# Altium project lv_io_project.PrjPCB (part 1 of 2)
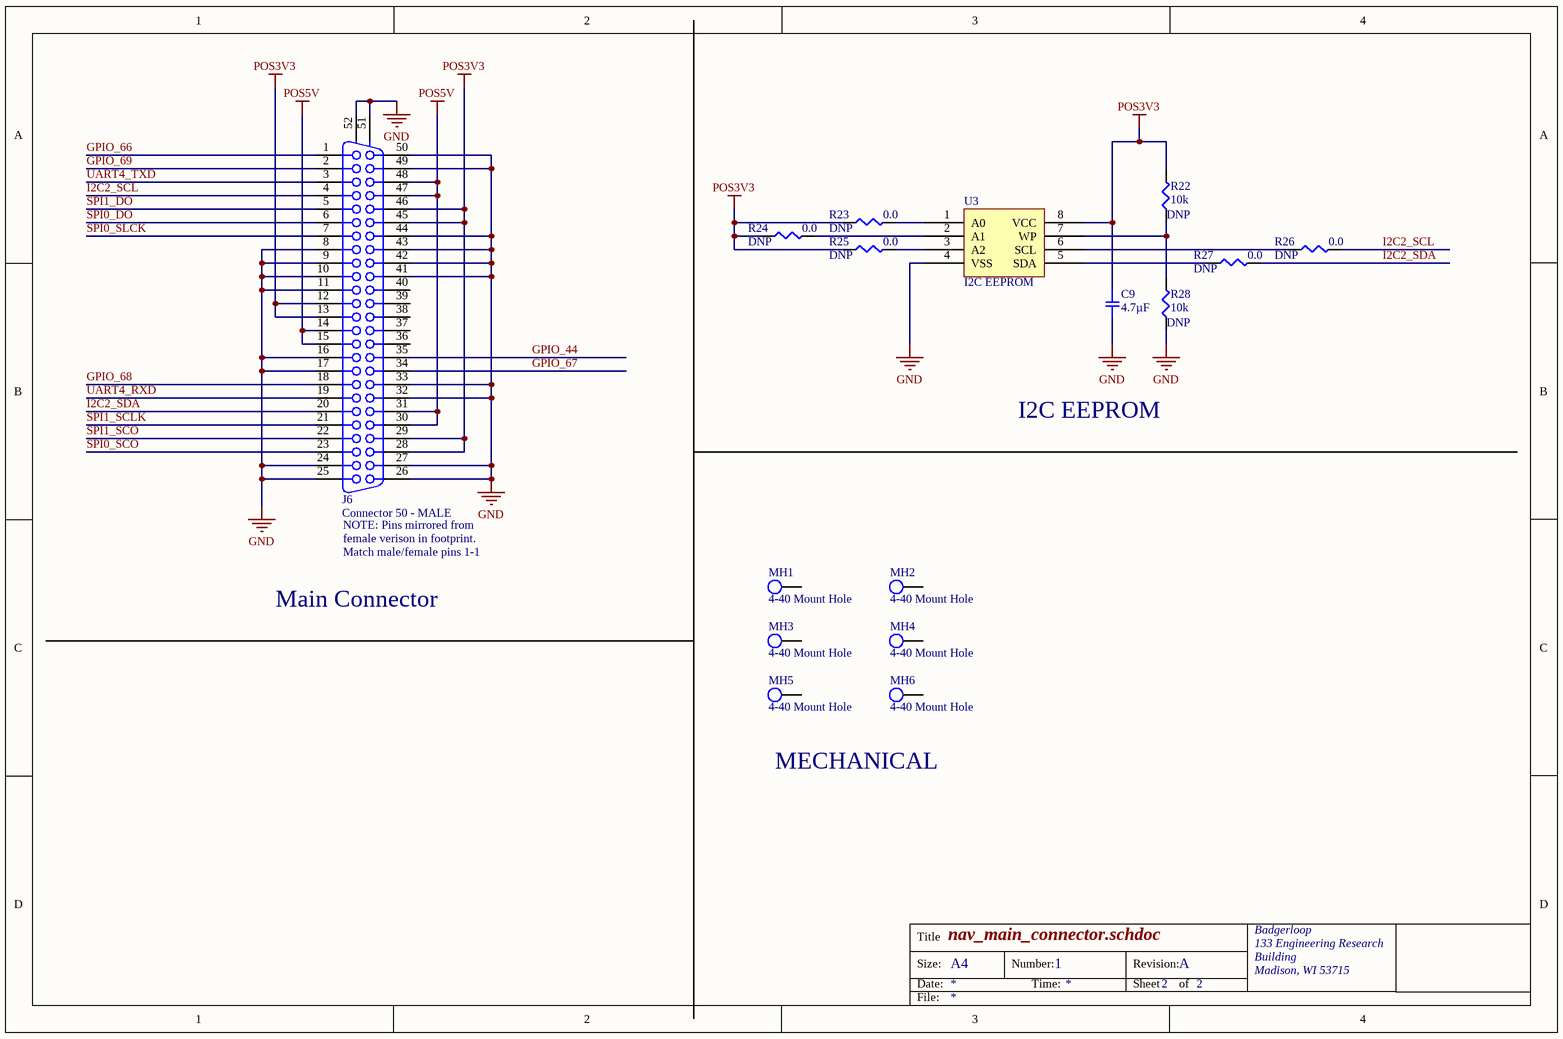
[diagram p0: lv_io_main_connector.SchDoc]
Engineer: Ryan Castle; PCB_Designer: Ryan Castle; Project: LV_IO; Revision: A; SerialNumber: 2019_03_A_1
9 sheets, 297 parts. Net scope: global (net labels, ports and power ports of the same name join across sheets).
Board file: lv_io_pcb.PcbDoc
Sheets:
  lv_io_main_connector.SchDoc
  lv_io_accel.SchDoc
  lv_io_harness.SchDoc
  lv_io_retro.SchDoc
  lv_io_pressure.SchDoc
  lv_io_solenoid_ctl.SchDoc
  lv_io_solenoid_drv.SchDoc
  lv_io_analog_input.SchDoc
  lv_io_lim.SchDoc

## Sheet lv_io_main_connector.SchDoc: nav_main_connector.schdoc
size A4; Engineer: Ryan Castle; Organization: Badgerloop; Address1: 133 Engineering Research; Address2: Building; Address3: Madison, WI 53715; DocumentNumber: 1; Revision: A; SheetNumber: 2; SheetTotal: 2

### Parts
C9  4.7µF  [SMD-0805C]
J6  Connector 50 - MALE  [050DSUB1.27-H96-MALE]
MH1  4-40 Mount Hole  [MH]
MH2  4-40 Mount Hole  [MH]
MH3  4-40 Mount Hole  [MH]
MH4  4-40 Mount Hole  [MH]
MH5  4-40 Mount Hole  [MH]
MH6  4-40 Mount Hole  [MH]
R22  10k  [SMD-0402-RES]
R23  0.0  [SMD-0402-RES]
R24  0.0  [SMD-0402-RES]
R25  0.0  [SMD-0402-RES]
R26  0.0  [SMD-0402-RES]
R27  0.0  [SMD-0402-RES]
R28  10k  [SMD-0402-RES]
U3  I2C EEPROM  [SOIC127P600X175-8N]

### Nets
GND: C9.2 J6.8 J6.9 J6.10 J6.11 J6.16 J6.17 J6.24 J6.25 J6.26 J6.27 J6.32 J6.33 J6.41 J6.42 J6.43 J6.44 J6.49 J6.50 J6.51 J6.52 R28.1 U3.4(VSS)
POS3V3: C9.1 J6.12 J6.13 J6.28 J6.29 J6.45 J6.46 R22.2 R23.1 R24.1 R25.1 U3.8(VCC)
POS5V: J6.14 J6.15 J6.30 J6.31 J6.47 J6.48
GPIO_44: J6.35
GPIO_66: J6.1
GPIO_67: J6.34
GPIO_68: J6.18
GPIO_69: J6.2
I2C2_SCL: J6.4 R26.2
I2C2_SDA: J6.20 R27.2
SPI0_DO: J6.6
SPI0_SCO: J6.23
SPI0_SLCK: J6.7
SPI1_DO: J6.5
SPI1_SCLK: J6.21
SPI1_SCO: J6.22
UART4_RXD: J6.19
UART4_TXD: J6.3
NetR22_1: R22.1 R28.2 U3.7(WP)
NetR23_2: R23.2 U3.1(A0)
NetR24_2: R24.2 U3.2(A1)
NetR25_2: R25.2 U3.3(A2)
NetR26_1: R26.1 U3.6(SCL)
NetR27_1: R27.1 U3.5(SDA)

Not connected (* = marked no-connect by the designer): J6 36 37 38 39 40; MH1 46; MH2 46; MH3 46; MH4 46; MH5 46; MH6 46

### Notes on the sheet
- I2C EEPROM
- (near J6) NOTE: Pins mirrored from
- Match male/female pins 1-1
- female verison in footprint.
- Main Connector
- MECHANICAL
- Title
- Size:
- Date:
- A4
- Number:
- Time:
- Revision:
- Sheet
- of
- File:

### Library data of the parts
C9 = GCJ21BR71C475KA01L: CAP CER 4.7UF 16V X7R 0805; Manufacturer: Murata Electronics North America; Factory Stock: 0; Unit Price (USD): 0.44; Minimum Quantity: 1; Tolerance: ±10%; Datasheets: http://www.murata.com/~/media/webrenewal/support/library/catalog/products/capacitor/mlcc/c03e.ashx; Image: //media.digikey.com/Renders/Murata%20Renders/0805%20(2012%20Metric)%20.85mm.jpg; Digi-Key Part Number: 490-10557-1-ND; Part Number: GCJ21BR71C475KA01L; Quantity Available: 53217; @ qty: 0; Packaging: Cut Tape (CT); Series: GCJ; Part Status: Active; Value: 4.7µF; Voltage: 16V; Temperature Coefficient: X7R; Operating Temperature: -55°C ~ 125°C; Features: Soft Termination; Ratings: AEC-Q200; Applications: Automotive, Boardflex Sensitive; Mounting Type: Surface Mount, MLCC; Package / Case: 0805 (2012 Metric); Size / Dimension: 0.079" L x 0.049" W (2.00mm x 1.25mm); Height - Seated (Max): -; Thickness (Max): 0.057" (1.45mm); Lead Spacing: -; Lead Style: -
J6 = Connector 50 - MALE: Receptacle Header Assemby; Manufacturer: HARTING; Manufacturer P/N: 09665627811; Digikey Link: https://www.digikey.com/product-detail/en/harting/09665627811/1195-5057-ND/4322749; Digikey P/N: 1195-5057-ND
R22 R28 = ERJ-2GEJ103X: RES SMD 10K OHM 5% 1/10W 0402; Manufacturer: Panasonic Electronic Components; Factory Stock: 0; Unit Price (USD): 0.00350; @ qty: 1500; Minimum Quantity: 1; Power (Watts): 0.1W, 1/10W; Temperature Coefficient: ±200ppm/°C; Part Number: ERJ-2GEJ103X; Datasheets: http://industrial.panasonic.com/www-cgi/jvcr13pz.cgi?E+PZ+3+AOA0001+ERJ2GEJ103X+7+WW; Image: //media.digikey.com/Photos/Panasonic%20Photos/ERJ-PA2-Series.jpg; Digi-Key Part Number: P10KJCT-ND; Quantity Available: 2560215; Packaging: Cut Tape (CT); Series: ERJ; Part Status: Active; Value: 10k; Tolerance: ±5%; Composition: Thick Film; Features: Automotive AEC-Q200; Operating Temperature: -55°C ~ 155°C; Package / Case: 0402 (1005 Metric); Supplier Device Package: 0402; Size / Dimension: 0.039" L x 0.020" W (1.00mm x 0.50mm); Height - Seated (Max): 0.016" (0.40mm); Number of Terminations: 2; Failure Rate: -; DNP: DNP
R23-R27 = ERJ-2GE0R00X: RES SMD 0.0OHM JUMPER 1/10W 0402; Manufacturer: Panasonic Electronic Components; Factory Stock: 0; Unit Price (USD): 0.00384; @ qty: 1500; Minimum Quantity: 1; Power (Watts): 0.1W, 1/10W; Part Number: ERJ-2GE0R00X; Datasheets: http://industrial.panasonic.com/www-cgi/jvcr13pz.cgi?E+PZ+3+AOA0001+ERJ2GE0R00X+7+WW; Image: //media.digikey.com/Photos/Panasonic%20Photos/ERJ-PA2-Series.jpg; Digi-Key Part Number: P0.0JCT-ND; Quantity Available: 3152483; Packaging: Cut Tape (CT); Series: ERJ; Part Status: Active; Value: 0.0; Tolerance: Jumper; Composition: Thick Film; Features: Automotive AEC-Q200; Temperature Coefficient: -; Operating Temperature: -55°C ~ 155°C; Package / Case: 0402 (1005 Metric); Supplier Device Package: 0402; Size / Dimension: 0.039" L x 0.020" W (1.00mm x 0.50mm); Height - Seated (Max): 0.016" (0.40mm); Number of Terminations: 2; Failure Rate: -; DNP: DNP
U3 = I2C EEPROM: IC EEPROM 32K I2C 1MHZ 8SOIC; Manufacturer: ON Semi; Manufacturer P/N: CAT24C32WI-GT3; Digikey P/N: CAT24C32WI-Gt3CT-ND

## Sheet lv_io_accel.SchDoc: nav_io.schdoc
size A4; Organization: Badgerloop; Address1: 133 Engineering Research; Address2: Building; Address3: Madison, WI 53715; DocumentNumber: 1; Revision: A; SheetNumber: 1; SheetTotal: 2
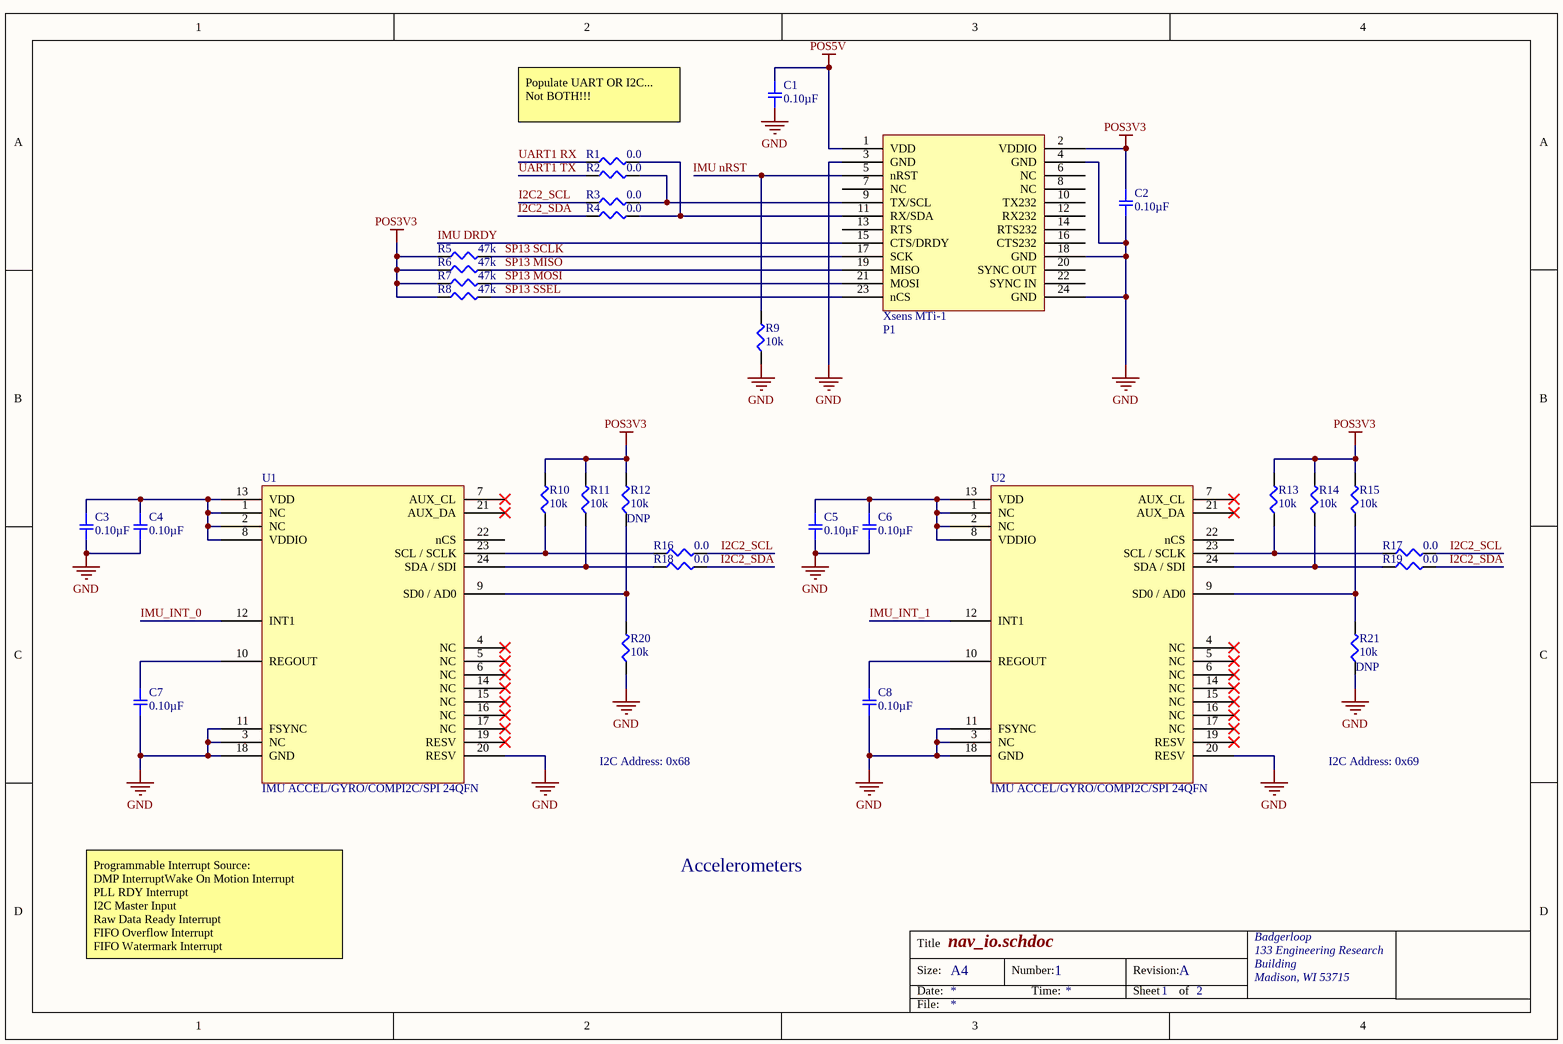
[diagram p1: lv_io_accel.SchDoc]

### Parts
(Parts that share a designator on the sheet are numbered #1, #2 ... from top to bottom, then left to right.)
C1  0.10µF  [SMD-0603C]
C2  0.10µF  [SMD-0603C]
C3  0.10µF  [SMD-0603C]
C4  0.10µF  [SMD-0603C]
C5  0.10µF  [SMD-0603C]
C6  0.10µF  [SMD-0603C]
C7  0.10µF  [SMD-0603C]
C8  0.10µF  [SMD-0603C]
P1  XSNS MTI-1  [MTI-3]  (value not drawn)
R1  0.0  [SMD-0402-RES]
R2  0.0  [SMD-0402-RES]
R3  0.0  [SMD-0402-RES]
R4  0.0  [SMD-0402-RES]
R5  47k  [SMD-0402-RES]
R6  47k  [SMD-0402-RES]
R7  47k  [SMD-0402-RES]
R8  47k  [SMD-0402-RES]
R9  10k  [SMD-0402-RES]
R10  10k  [SMD-0402-RES]
R11  10k  [SMD-0402-RES]
R12  10k  [SMD-0402-RES]
R13#1  10k  [SMD-0402-RES]
R14#1  10k  [SMD-0402-RES]
R15  10k  [SMD-0402-RES]
R16  0.0  [SMD-0402-RES]
R17  0.0  [SMD-0402-RES]
R18  0.0  [SMD-0402-RES]
R19  0.0  [SMD-0402-RES]
R20  10k  [SMD-0402-RES]
R21  10k  [SMD-0402-RES]
U1  IMU ACCEL/GYRO/COMPI2C/SPI 24QFN  [QFN40P300X300X105_HS-25N]
U2  IMU ACCEL/GYRO/COMPI2C/SPI 24QFN  [QFN40P300X300X105_HS-25N]

### Nets
GND: C1.2 C2.2 C3.2 C4.2 C5.2 C6.2 C7.2 C8.2 P1.3(GND) P1.4(GND) P1.18(GND) P1.24(GND) R9.1 R20.1 R21.1 U1.3(NC) U1.11(FSYNC) U1.18(GND) U1.20(RESV) U2.3(NC) U2.11(FSYNC) U2.18(GND) U2.20(RESV)
POS3V3: C2.1 P1.2(VDDIO) R5.1 R6.1 R7.1 R8.1 R10.2 R11.2 R12.2 R13#1.2 R14#1.2 R15.2
POS5V: C1.1 P1.1(VDD)
I2C2_SCL: R3.1 R16.2 R17.2
I2C2_SDA: R4.1 R18.2 R19.2
IMU DRDY: P1.15(CTS/DRDY)
IMU_INT_0: U1.12(INT1)
IMU_INT_1: U2.12(INT1)
SP13 MISO: P1.19(MISO) R6.2
SP13 MOSI: P1.21(MOSI) R7.2
SP13 SCLK: P1.17(SCK) R5.2
SP13 SSEL: P1.23(nCS) R8.2
UART1 RX: R1.1
UART1 TX: R2.1
NetC3_1: C3.1 C4.1 U1.1(NC) U1.2(NC) U1.8(VDDIO) U1.13(VDD)
NetC5_1: C5.1 C6.1 U2.1(NC) U2.2(NC) U2.8(VDDIO) U2.13(VDD)
NetC7_1: C7.1 U1.10(REGOUT)
NetC8_1: C8.1 U2.10(REGOUT)
NetP1_5: P1.5(nRST) R9.2
NetP1_9: P1.9(TX/SCL) R2.2 R3.2
NetP1_11: P1.11(RX/SDA) R1.2 R4.2
NetR10_1: R10.1 R16.1 U1.23(SCL_/_SCLK)
NetR11_1: R11.1 R18.1 U1.24(SDA_/_SDI)
NetR12_1: R12.1 R20.2 U1.9(SD0_/_AD0)
NetR13#1_1: R13#1.1 R17.1 U2.23(SCL_/_SCLK)
NetR14#1_1: R14#1.1 R19.1 U2.24(SDA_/_SDI)
NetR15_1: R15.1 R21.2 U2.9(SD0_/_AD0)

Not connected (* = marked no-connect by the designer): P1 6(NC) 7(NC) 8(NC) 10(TX232) 12(RX232) 13(RTS) 14(RTS232) 16(CTS232) 20(SYNC_OUT) 22(SYNC_IN); U1 4(NC)* 5(NC)* 6(NC)* 7(AUX_CL)* 14(NC)* 15(NC)* 16(NC)* 17(NC)* 19(RESV)* 21(AUX_DA)* 22(nCS); U2 4(NC)* 5(NC)* 6(NC)* 7(AUX_CL)* 14(NC)* 15(NC)* 16(NC)* 17(NC)* 19(RESV)* 21(AUX_DA)* 22(nCS)

### Notes on the sheet
- Populate UART OR I2C...
  Not BOTH!!!
- I2C Address: 0x68
- I2C Address: 0x69
- Accelerometers
- Programmable Interrupt Source:
  DMP InterruptWake On Motion Interrupt
  PLL RDY Interrupt
  I2C Master Input
  Raw Data Ready Interrupt
  FIFO Overflow Interrupt
  FIFO Watermark Interrupt
- Labels drawn without touching a wire or pin: IMU nRST
- Title
- Size:
- Date:
- A4
- Number:
- Time:
- Revision:
- Sheet
- of
- File:
- (in symbol XSNS MTI-1) Xsens MTi-1

### Library data of the parts
C1-C8 = GRM188R72A104KA35J: CAP CER 0.1UF 100V X7R 0603; Manufacturer: Murata Electronics North America; Factory Stock: 0; Unit Price (USD): 0.28; Minimum Quantity: 1; Tolerance: ±10%; Datasheets: http://www.murata.com/~/media/webrenewal/support/library/catalog/products/capacitor/mlcc/c02e.pdf; Image: //media.digikey.com/Renders/Murata%20Renders/ZRB-SERIES-0402.jpg; Digi-Key Part Number: 490-6439-1-ND; Part Number: GRM188R72A104KA35J; Quantity Available: 19148; @ qty: 0; Packaging: Cut Tape (CT); Series: GRM; Part Status: Active; Value: 0.10µF; Voltage: 100V; Temperature Coefficient: X7R; Operating Temperature: -55°C ~ 125°C; Features: -; Ratings: -; Applications: General Purpose; Mounting Type: Surface Mount, MLCC; Package / Case: 0603 (1608 Metric); Size / Dimension: 0.063" L x 0.031" W (1.60mm x 0.80mm); Height - Seated (Max): -; Thickness (Max): 0.035" (0.90mm); Lead Spacing: -; Lead Style: -
P1 = XSNS MTI-1: Manufacturer: Xsens; Manufacturer P/N: MTI-3-DK; Digikey Link: https://www.mouser.com/ProductDetail/Xsens/MTI-3-DK?qs=55YtniHzbhBGvlIRYNoxgQ%3d%3d; Digikey P/N: 512-MTI-3-DK
R1-R4 R16-R19 = ERJ-2GE0R00X: as R23 on sheet lv_io_main_connector; Part Number: ERJ-2GE0R00X; Datasheets: http://industrial.panasonic.com/www-cgi/jvcr13pz.cgi?E+PZ+3+AOA0001+ERJ2GE0R00X+7+WW; Image: //media.digikey.com/Photos/Panasonic%20Photos/ERJ-PA2-Series.jpg; Digi-Key Part Number: P0.0JCT-ND; Quantity Available: 3152483; Packaging: Cut Tape (CT); Series: ERJ; Part Status: Active; Value: 0.0; Tolerance: Jumper; Composition: Thick Film; Features: Automotive AEC-Q200; Temperature Coefficient: -; Operating Temperature: -55°C ~ 155°C; Package / Case: 0402 (1005 Metric); Supplier Device Package: 0402; Size / Dimension: 0.039" L x 0.020" W (1.00mm x 0.50mm); Height - Seated (Max): 0.016" (0.40mm); Number of Terminations: 2; Failure Rate: -
R5-R8 = ERJ-2GEJ473X: RES SMD 47K OHM 5% 1/10W 0402; Manufacturer: Panasonic Electronic Components; Factory Stock: 0; Unit Price (USD): 0.00350; @ qty: 1500; Minimum Quantity: 1; Power (Watts): 0.1W, 1/10W; Temperature Coefficient: ±200ppm/°C; Part Number: ERJ-2GEJ473X; Datasheets: http://industrial.panasonic.com/www-cgi/jvcr13pz.cgi?E+PZ+3+AOA0001+ERJ2GEJ473X+7+WW; Image: //media.digikey.com/Photos/Panasonic%20Photos/ERJ-PA2-Series.jpg; Digi-Key Part Number: P47KJCT-ND; Quantity Available: 5182645; Packaging: Cut Tape (CT); Series: ERJ; Part Status: Active; Value: 47k; Tolerance: ±5%; Composition: Thick Film; Features: Automotive AEC-Q200; Operating Temperature: -55°C ~ 155°C; Package / Case: 0402 (1005 Metric); Supplier Device Package: 0402; Size / Dimension: 0.039" L x 0.020" W (1.00mm x 0.50mm); Height - Seated (Max): 0.016" (0.40mm); Number of Terminations: 2; Failure Rate: -
R9-R12 R13#1 R14#1 R15 R20 R21 = ERJ-PA2F1002X: RES SMD 10K OHM 1% 1/5W 0402; Manufacturer: Panasonic Electronic Components; Factory Stock: 0; Unit Price (USD): 0.03029; @ qty: 1500; Minimum Quantity: 1; Power (Watts): 0.2W, 1/5W; Temperature Coefficient: ±100ppm/°C; Part Number: ERJ-PA2F1002X; Datasheets: https://industrial.panasonic.com/cdbs/www-data/pdf/RDA0000/AOA0000C243.pdf; Image: //media.digikey.com/Photos/Panasonic%20Photos/ERJ-PA2-Series.jpg; Digi-Key Part Number: P17230CT-ND; Quantity Available: 12292; Packaging: Cut Tape (CT); Series: ERJ; Part Status: Active; Value: 10k; Tolerance: ±1%; Composition: Thick Film; Features: Automotive AEC-Q200, Pulse Withstanding; Operating Temperature: -55°C ~ 155°C; Package / Case: 0402 (1005 Metric); Supplier Device Package: 0402; Size / Dimension: 0.039" L x 0.020" W (1.00mm x 0.50mm); Height - Seated (Max): 0.016" (0.40mm); Number of Terminations: 2; Failure Rate: -
  R12 R21: DNP: DNP
U1 U2 = ICM-20948: Manufacturer: TDK InvenSense; Digikey Link: https://www.digikey.com/product-detail/en/tdk-invensense/ICM-20948/1428-1123-1-ND/7062698; Digikey P/N: 1428-1123-1-ND; Manufacturer P/N: ICM-20948

## Sheet lv_io_harness.SchDoc
size A4; Organization: Badgerloop; Address1: 133 Engineering Research; Address2: Building; Address3: Madison, WI 53715
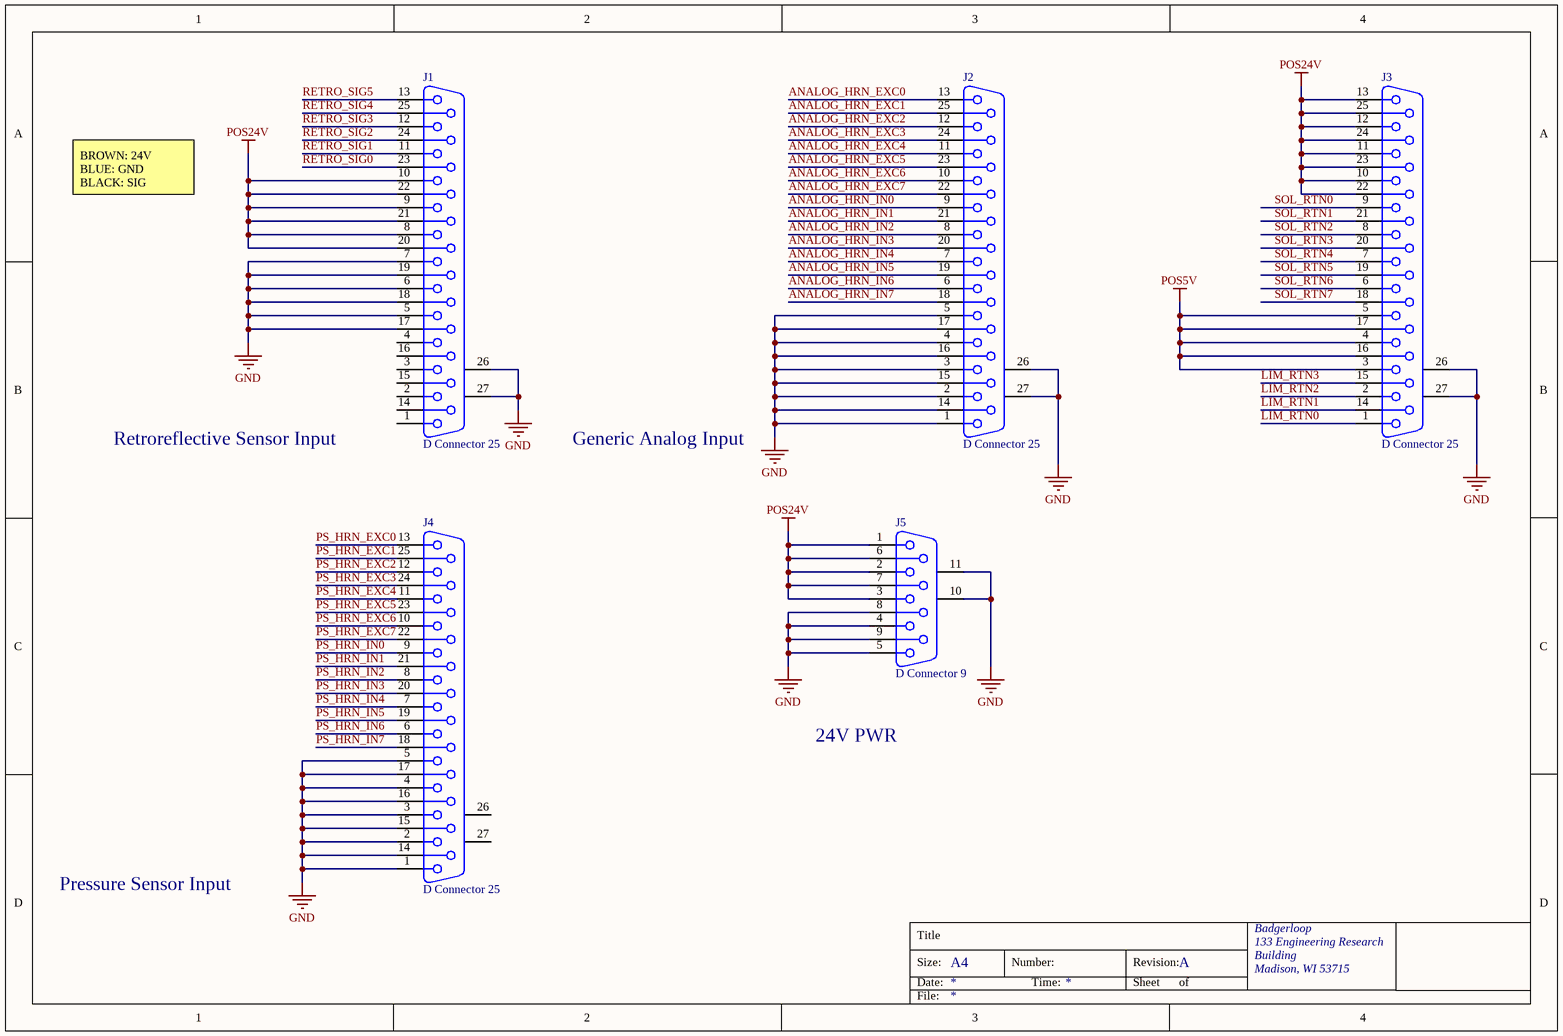
[diagram p2: lv_io_harness.SchDoc]

### Parts
J1  D Connector 25  [DSUB1.385-2H25A]
J2  D Connector 25  [DSUB1.385-2H25A]
J3  D Connector 25  [DSUB1.385-2H25A]
J4  D Connector 25  [DSUB1.385-2H25A]
J5  D Connector 9  [DSUB1.385-2H9]

### Nets
GND: J1.5 J1.6 J1.7 J1.17 J1.18 J1.19 J1.26(MH1) J1.27(MH2) J2.1 J2.2 J2.3 J2.4 J2.5 J2.14 J2.15 J2.16 J2.17 J2.26(MH1) J2.27(MH2) J3.26(MH1) J3.27(MH2) J4.1 J4.2 J4.3 J4.4 J4.5 J4.14 J4.15 J4.16 J4.17 J5.4 J5.5 J5.8 J5.9 J5.10(MH1) J5.11(MH2)
POS5V: J3.3 J3.4 J3.5 J3.16 J3.17
POS24V: J1.8 J1.9 J1.10 J1.20 J1.21 J1.22 J3.10 J3.11 J3.12 J3.13 J3.22 J3.23 J3.24 J3.25 J5.1 J5.2 J5.3 J5.6 J5.7
ANALOG_HRN_EXC0: J2.13
ANALOG_HRN_EXC1: J2.25
ANALOG_HRN_EXC2: J2.12
ANALOG_HRN_EXC3: J2.24
ANALOG_HRN_EXC4: J2.11
ANALOG_HRN_EXC5: J2.23
ANALOG_HRN_EXC6: J2.10
ANALOG_HRN_EXC7: J2.22
ANALOG_HRN_IN0: J2.9
ANALOG_HRN_IN1: J2.21
ANALOG_HRN_IN2: J2.8
ANALOG_HRN_IN3: J2.20
ANALOG_HRN_IN4: J2.7
ANALOG_HRN_IN5: J2.19
ANALOG_HRN_IN6: J2.6
ANALOG_HRN_IN7: J2.18
LIM_RTN0: J3.1
LIM_RTN1: J3.14
LIM_RTN2: J3.2
LIM_RTN3: J3.15
PS_HRN_EXC0: J4.13
PS_HRN_EXC1: J4.25
PS_HRN_EXC2: J4.12
PS_HRN_EXC3: J4.24
PS_HRN_EXC4: J4.11
PS_HRN_EXC5: J4.23
PS_HRN_EXC6: J4.10
PS_HRN_EXC7: J4.22
PS_HRN_IN0: J4.9
PS_HRN_IN1: J4.21
PS_HRN_IN2: J4.8
PS_HRN_IN3: J4.20
PS_HRN_IN4: J4.7
PS_HRN_IN5: J4.19
PS_HRN_IN6: J4.6
PS_HRN_IN7: J4.18
RETRO_SIG0: J1.23
RETRO_SIG1: J1.11
RETRO_SIG2: J1.24
RETRO_SIG3: J1.12
RETRO_SIG4: J1.25
RETRO_SIG5: J1.13
SOL_RTN0: J3.9
SOL_RTN1: J3.21
SOL_RTN2: J3.8
SOL_RTN3: J3.20
SOL_RTN4: J3.7
SOL_RTN5: J3.19
SOL_RTN6: J3.6
SOL_RTN7: J3.18

Not connected (* = marked no-connect by the designer): J1 1 2 3 4 14 15 16; J4 26(MH1) 27(MH2)

### Notes on the sheet
- BROWN: 24V
  BLUE: GND
  BLACK: SIG
- (near J1) Retroreflective Sensor Input
- Generic Analog Input
- 24V PWR
- Pressure Sensor Input
- Title
- Size:
- Date:
- A4
- Number:
- Time:
- Revision:
- Sheet
- of
- File:

### Library data of the parts
J1-J4 = D Connector 25: Receptacle Assembly, 25 Position, Right Angle; PackageDocument: U; Positions: 25; Published: 15-Jun-2001; LatestRevisionDate: 17-Jul-2002; LatestRevisionNote: Re-released for DXP Platform.; DatasheetDocument: 19-Mar-1999; PackageReference: 787202; Publisher: Altium Limited; Orientation: Right Angle; Gender: Receptacle
J5 = D Connector 9: Receptacle Assembly, 9 Position, Right Angle; PackageDocument: O; Positions: 9; Published: 15-Jun-2001; LatestRevisionDate: 17-Jul-2002; LatestRevisionNote: Re-released for DXP Platform.; DatasheetDocument: 1-Sep-1999; PackageReference: 788750; Publisher: Altium Limited; Orientation: Right Angle; Gender: Receptacle

## Sheet lv_io_retro.SchDoc
size A4; Organization: Badgerloop; Address1: 133 Engineering Research; Address2: Building; Address3: Madison, WI 53715
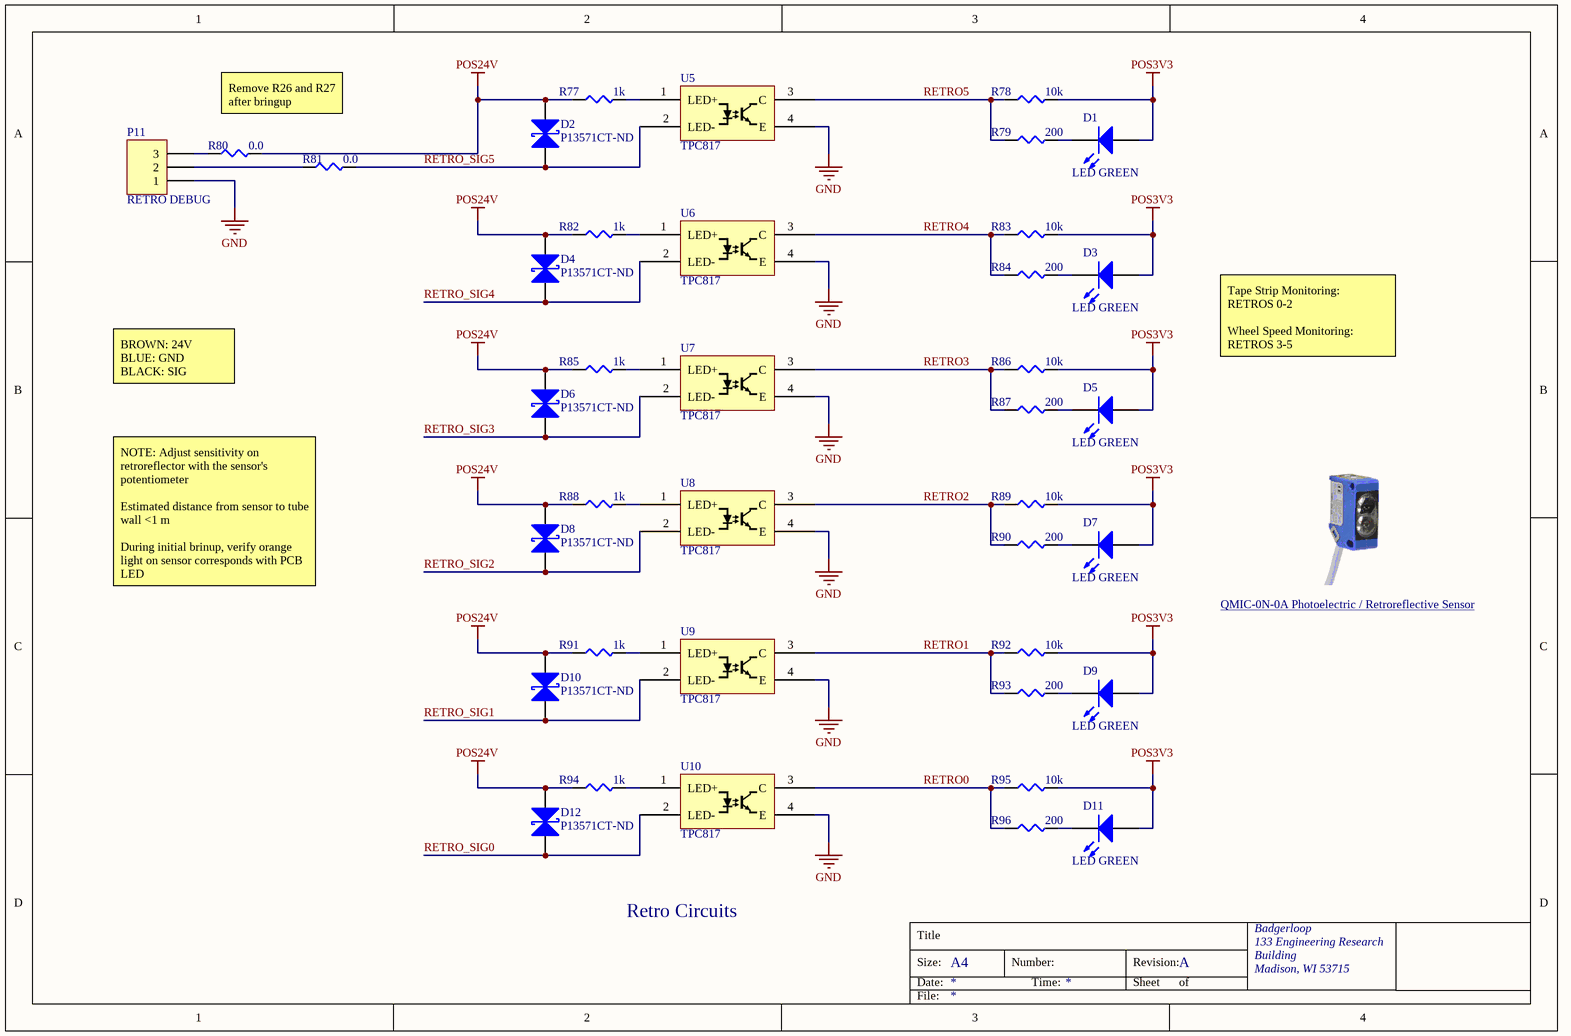
[diagram p3: lv_io_retro.SchDoc]

### Parts
D1  LED GREEN  [LED 0603 GREEN]
D2  Digikey P/N: P13571CT-ND  [SMD-0402-RES]  (hidden comment: ESD Diode)
D3  LED GREEN  [LED 0603 GREEN]
D4  Digikey P/N: P13571CT-ND  [SMD-0402-RES]  (hidden comment: ESD Diode)
D5  LED GREEN  [LED 0603 GREEN]
D6  Digikey P/N: P13571CT-ND  [SMD-0402-RES]  (hidden comment: ESD Diode)
D7  LED GREEN  [LED 0603 GREEN]
D8  Digikey P/N: P13571CT-ND  [SMD-0402-RES]  (hidden comment: ESD Diode)
D9  LED GREEN  [LED 0603 GREEN]
D10  Digikey P/N: P13571CT-ND  [SMD-0402-RES]  (hidden comment: ESD Diode)
D11  LED GREEN  [LED 0603 GREEN]
D12  Digikey P/N: P13571CT-ND  [SMD-0402-RES]  (hidden comment: ESD Diode)
P11  RETRO DEBUG  [Pin Header 1x3 TH Pitch 2.54mm]
R77  1k  [SMD-0603-RES]
R78  10k  [SMD-0603-RES]
R79  200  [SMD-0603-RES]
R80  0.0  [SMD-0402-RES]
R81  0.0  [SMD-0402-RES]
R82  1k  [SMD-0603-RES]
R83  10k  [SMD-0603-RES]
R84  200  [SMD-0603-RES]
R85  1k  [SMD-0603-RES]
R86  10k  [SMD-0603-RES]
R87  200  [SMD-0603-RES]
R88  1k  [SMD-0603-RES]
R89  10k  [SMD-0603-RES]
R90  200  [SMD-0603-RES]
R91  1k  [SMD-0603-RES]
R92  10k  [SMD-0603-RES]
R93  200  [SMD-0603-RES]
R94  1k  [SMD-0603-RES]
R95  10k  [SMD-0603-RES]
R96  200  [SMD-0603-RES]
U5  TPC817  [SOT200P1005X328-5N]
U6  TPC817  [SOT200P1005X328-5N]
U7  TPC817  [SOT200P1005X328-5N]
U8  TPC817  [SOT200P1005X328-5N]
U9  TPC817  [SOT200P1005X328-5N]
U10  TPC817  [SOT200P1005X328-5N]

### Nets
GND: P11.1 U5.4(E) U6.4(E) U7.4(E) U8.4(E) U9.4(E) U10.4(E)
POS3V3: D1.1(A) D3.1(A) D5.1(A) D7.1(A) D9.1(A) D11.1(A) R78.2 R83.2 R86.2 R89.2 R92.2 R95.2
POS24V: D2.2(K) D4.2(K) D6.2(K) D8.2(K) D10.2(K) D12.2(K) R77.1 R80.2 R82.1 R85.1 R88.1 R91.1 R94.1
RETRO0: R95.1 R96.1 U10.3(C)
RETRO1: R92.1 R93.1 U9.3(C)
RETRO2: R89.1 R90.1 U8.3(C)
RETRO3: R86.1 R87.1 U7.3(C)
RETRO4: R83.1 R84.1 U6.3(C)
RETRO5: R78.1 R79.1 U5.3(C)
RETRO_SIG0: D12.1(A) U10.2(LED-)
RETRO_SIG1: D10.1(A) U9.2(LED-)
RETRO_SIG2: D8.1(A) U8.2(LED-)
RETRO_SIG3: D6.1(A) U7.2(LED-)
RETRO_SIG4: D4.1(A) U6.2(LED-)
RETRO_SIG5: D2.1(A) R81.2 U5.2(LED-)
NetD1_2: D1.2(K) R79.2
NetD3_2: D3.2(K) R84.2
NetD5_2: D5.2(K) R87.2
NetD7_2: D7.2(K) R90.2
NetD9_2: D9.2(K) R93.2
NetD11_2: D11.2(K) R96.2
NetP11_2: P11.2 R81.1
NetP11_3: P11.3 R80.1
NetR77_2: R77.2 U5.1(LED+)
NetR82_2: R82.2 U6.1(LED+)
NetR85_2: R85.2 U7.1(LED+)
NetR88_2: R88.2 U8.1(LED+)
NetR91_2: R91.2 U9.1(LED+)
NetR94_2: R94.2 U10.1(LED+)

### Notes on the sheet
- Remove R26 and R27 after bringup
- BROWN: 24V
  BLUE: GND
  BLACK: SIG
- Tape Strip Monitoring:
  RETROS 0-2
  Wheel Speed Monitoring:
  RETROS 3-5
- NOTE: Adjust sensitivity on retroreflector with the sensor's potentiometer
  Estimated distance from sensor to tube wall <1 m
  During initial brinup, verify orange light on sensor corresponds with PCB LED
- QMIC-0N-0A Photoelectric / Retroreflective Sensor <https://www.automationdirect.com/adc/shopping/catalog/sensors_-z-_encoders/photoelectric_sensors/dc_rectangular/retroreflective_(qm-z-cx-z-fe_series)/qmic-0n-0a>
- Retro Circuits
- Title
- Size:
- Date:
- A4
- Number:
- Time:
- Revision:
- Sheet
- of
- File:

### Library data of the parts
D1 D3 D5 D7 D9 D11 = LED GREEN 0603: Manufacturer: Lite-On Inc.; Manufacturer P/N: LTST-C190KGKT; Digikey P/N: 160-1435-1-ND; Package / Case: 0603; Color: GREEN
D2 D4 D6 D8 D10 D12 = ESD Diode: ESD Supressor; Manufacturer P/N: Panasonic; Manufacturer: EZAEG; Digikey Link: https://www.digikey.com/product-detail/en/panasonic-electronic-components/EZA-EG2A50AX/P13571CT-ND/1137239
P11 = Header 3: Header, 3-Pin; LatestRevisionDate: 17-Jul-2002; LatestRevisionNote: Re-released for DXP Platform.; Publisher: Altium Limited
R77 R82 R85 R88 R91 R94 = ERJ-P03F1001V: RES SMD 1K OHM 1% 1/5W 0603; Manufacturer: Panasonic Electronic Components; Factory Stock: 0; Unit Price (USD): 0.05227; @ qty: 1500; Minimum Quantity: 1; Power (Watts): 0.2W, 1/5W; Temperature Coefficient: ±200ppm/°C; Value: 1k; Part Number: ERJ-P03F1001V; Datasheets: https://industrial.panasonic.com/cdbs/www-data/pdf/RDA0000/AOA0000C243.pdf; Image: //media.digikey.com/Photos/Panasonic%20Photos/MFG_ERJ-P6W%20Series.jpg; Digi-Key Part Number: P16018CT-ND; Quantity Available: 3331; Packaging: Cut Tape (CT); Series: ERJ; Part Status: Active; Tolerance: ±1%; Composition: Thick Film; Features: Automotive AEC-Q200, Pulse Withstanding; Operating Temperature: -55°C ~ 155°C; Package / Case: 0603 (1608 Metric); Supplier Device Package: 0603; Size / Dimension: 0.063" L x 0.031" W (1.60mm x 0.80mm); Height - Seated (Max): 0.022" (0.55mm); Number of Terminations: 2; Failure Rate: -
R78 R83 R86 R89 R92 R95 = ERJ-P03J103V: RES SMD 10K OHM 5% 1/5W 0603; Manufacturer: Panasonic Electronic Components; Factory Stock: 0; Unit Price (USD): 0.03584; @ qty: 1500; Minimum Quantity: 1; Power (Watts): 0.2W, 1/5W; Temperature Coefficient: ±200ppm/°C; Value: 10k; Part Number: ERJ-P03J103V; Datasheets: https://industrial.panasonic.com/cdbs/www-data/pdf/RDA0000/AOA0000C243.pdf; Image: //media.digikey.com/Photos/Panasonic%20Photos/MFG_ERJ-P6W%20Series.jpg; Digi-Key Part Number: P16032CT-ND; Quantity Available: 857; Packaging: Cut Tape (CT); Series: ERJ; Part Status: Active; Tolerance: ±5%; Composition: Thick Film; Features: Automotive AEC-Q200, Pulse Withstanding; Operating Temperature: -55°C ~ 155°C; Package / Case: 0603 (1608 Metric); Supplier Device Package: 0603; Size / Dimension: 0.063" L x 0.031" W (1.60mm x 0.80mm); Height - Seated (Max): 0.022" (0.55mm); Number of Terminations: 2; Failure Rate: -
R79 R84 R87 R90 R93 R96 = ERJ-P03J201V: RES SMD 200 OHM 5% 1/5W 0603; Manufacturer: Panasonic Electronic Components; Factory Stock: 0; Unit Price (USD): 0.03584; @ qty: 1500; Minimum Quantity: 1; Power (Watts): 0.2W, 1/5W; Temperature Coefficient: ±200ppm/°C; Value: 200; Part Number: ERJ-P03J201V; Datasheets: https://industrial.panasonic.com/cdbs/www-data/pdf/RDA0000/AOA0000C243.pdf; Image: //media.digikey.com/Photos/Panasonic%20Photos/MFG_ERJ-P6W%20Series.jpg; Digi-Key Part Number: P16033CT-ND; Quantity Available: 6803; Packaging: Cut Tape (CT); Series: ERJ; Part Status: Active; Tolerance: ±5%; Composition: Thick Film; Features: Automotive AEC-Q200, Pulse Withstanding; Operating Temperature: -55°C ~ 155°C; Package / Case: 0603 (1608 Metric); Supplier Device Package: 0603; Size / Dimension: 0.063" L x 0.031" W (1.60mm x 0.80mm); Height - Seated (Max): 0.022" (0.55mm); Number of Terminations: 2; Failure Rate: -
R80 R81 = ERJ-2GE0R00X: as R23 on sheet lv_io_main_connector; Part Number: ERJ-2GE0R00X; Datasheets: http://industrial.panasonic.com/www-cgi/jvcr13pz.cgi?E+PZ+3+AOA0001+ERJ2GE0R00X+7+WW; Image: //media.digikey.com/Photos/Panasonic%20Photos/ERJ-PA2-Series.jpg; Digi-Key Part Number: P0.0JCT-ND; Quantity Available: 3152483; Packaging: Cut Tape (CT); Series: ERJ; Part Status: Active; Value: 0.0; Tolerance: Jumper; Composition: Thick Film; Features: Automotive AEC-Q200; Temperature Coefficient: -; Operating Temperature: -55°C ~ 155°C; Package / Case: 0402 (1005 Metric); Supplier Device Package: 0402; Size / Dimension: 0.039" L x 0.020" W (1.00mm x 0.50mm); Height - Seated (Max): 0.016" (0.40mm); Number of Terminations: 2; Failure Rate: -
U5-U10 = TPC817: OPTOISO 5KV TRANS 4SOP; Manufacturer: Taiwan Semi; Manufacturer P/N: TPC817S1B RAG; Digikey Link: https://www.digikey.com/product-detail/en/taiwan-semiconductor-corporation/TPC817S1B-RAG/TPC817S1BRAGCT-ND/7359679; Digikey P/N: TPC817S1BRAGCT-ND

## Sheet lv_io_pressure.SchDoc
size A4; Organization: Badgerloop; Address1: 133 Engineering Research; Address2: Building; Address3: Madison, WI 53715
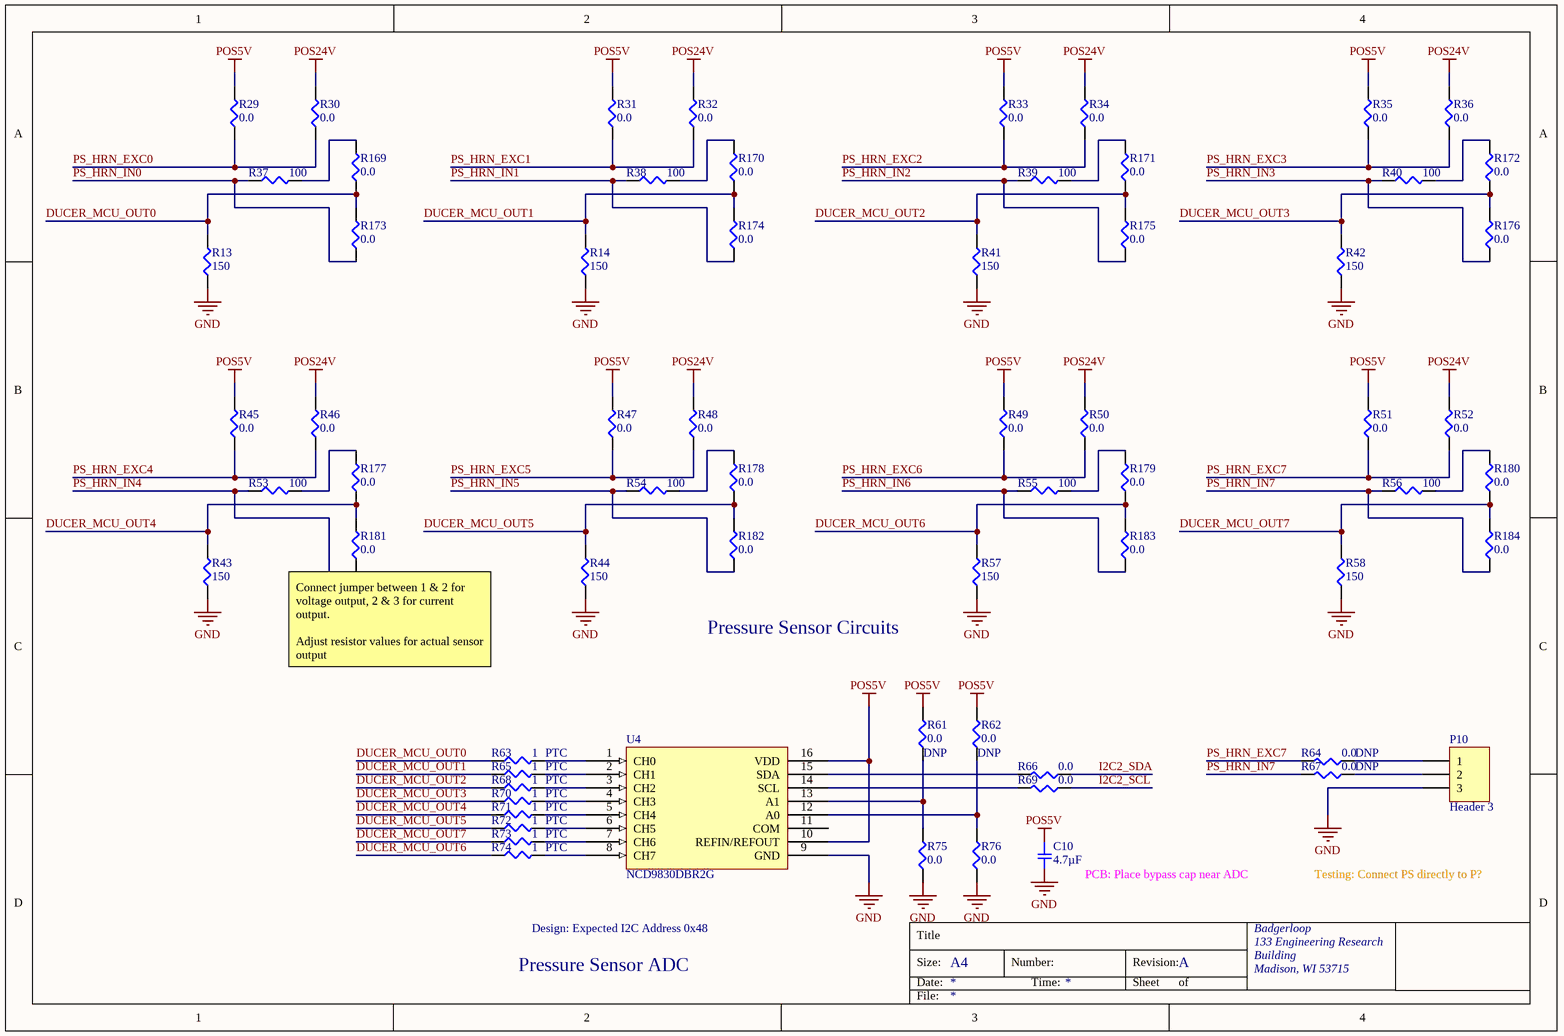
[diagram p4: lv_io_pressure.SchDoc]

### Parts
(Parts that share a designator on the sheet are numbered #1, #2 ... from top to bottom, then left to right.)
C10  4.7µF  [SMD-0805C]
P10  Header 3  [Pin Header 1x3 TH Pitch 2.54mm]
R13#2  150  [SMD-0402-RES]
R14#2  150  [SMD-0402-RES]
R29  0.0  [SMD-0402-RES]
R30  0.0  [SMD-0402-RES]
R31  0.0  [SMD-0402-RES]
R32  0.0  [SMD-0402-RES]
R33  0.0  [SMD-0402-RES]
R34  0.0  [SMD-0402-RES]
R35  0.0  [SMD-0402-RES]
R36  0.0  [SMD-0402-RES]
R37  100  [SMD-0402-RES]
R38  100  [SMD-0402-RES]
R39  100  [SMD-0402-RES]
R40  100  [SMD-0402-RES]
R41  150  [SMD-0402-RES]
R42  150  [SMD-0402-RES]
R43  150  [SMD-0402-RES]
R44  150  [SMD-0402-RES]
R45  0.0  [SMD-0402-RES]
R46  0.0  [SMD-0402-RES]
R47  0.0  [SMD-0402-RES]
R48  0.0  [SMD-0402-RES]
R49  0.0  [SMD-0402-RES]
R50  0.0  [SMD-0402-RES]
R51  0.0  [SMD-0402-RES]
R52  0.0  [SMD-0402-RES]
R53  100  [SMD-0402-RES]
R54  100  [SMD-0402-RES]
R55  100  [SMD-0402-RES]
R56  100  [SMD-0402-RES]
R57  150  [SMD-0402-RES]
R58  150  [SMD-0402-RES]
R61  0.0  [SMD-0402-RES]
R62  0.0  [SMD-0402-RES]
R63  1  Features: PTC  [SMD-0603-RES]
R64  0.0  [SMD-0402-RES]
R65  1  Features: PTC  [SMD-0603-RES]
R66  0.0  [SMD-0402-RES]
R67  0.0  [SMD-0402-RES]
R68  1  Features: PTC  [SMD-0603-RES]
R69  0.0  [SMD-0402-RES]
R70  1  Features: PTC  [SMD-0603-RES]
R71  1  Features: PTC  [SMD-0603-RES]
R72  1  Features: PTC  [SMD-0603-RES]
R73  1  Features: PTC  [SMD-0603-RES]
R74  1  Features: PTC  [SMD-0603-RES]
R75  0.0  [SMD-0402-RES]
R76  0.0  [SMD-0402-RES]
R169  0.0  [SMD-0402-RES]
R170  0.0  [SMD-0402-RES]
R171  0.0  [SMD-0402-RES]
R172  0.0  [SMD-0402-RES]
R173  0.0  [SMD-0402-RES]
R174  0.0  [SMD-0402-RES]
R175  0.0  [SMD-0402-RES]
R176  0.0  [SMD-0402-RES]
R177  0.0  [SMD-0402-RES]
R178  0.0  [SMD-0402-RES]
R179  0.0  [SMD-0402-RES]
R180  0.0  [SMD-0402-RES]
R181  0.0  [SMD-0402-RES]
R182  0.0  [SMD-0402-RES]
R183  0.0  [SMD-0402-RES]
R184  0.0  [SMD-0402-RES]
U4  NCD9830DBR2G  [TSOP65P640X120_HS-17N]

### Nets
GND: C10.2 P10.3 R13#2.1 R14#2.1 R41.1 R42.1 R43.1 R44.1 R57.1 R58.1 R75.1 R76.1 U4.9(GND)
POS5V: C10.1 R29.2 R31.2 R33.2 R35.2 R45.2 R47.2 R49.2 R51.2 R61.2 R62.2 U4.10(REFIN/REFOUT) U4.16(VDD)
POS24V: R30.2 R32.2 R34.2 R36.2 R46.2 R48.2 R50.2 R52.2
DUCER_MCU_OUT0: R13#2.2 R63.1 R169.1 R173.2
DUCER_MCU_OUT1: R14#2.2 R65.1 R170.1 R174.2
DUCER_MCU_OUT2: R41.2 R68.1 R171.1 R175.2
DUCER_MCU_OUT3: R42.2 R70.1 R172.1 R176.2
DUCER_MCU_OUT4: R43.2 R71.1 R177.1 R181.2
DUCER_MCU_OUT5: R44.2 R72.1 R178.1 R182.2
DUCER_MCU_OUT6: R57.2 R74.1 R179.1 R183.2
DUCER_MCU_OUT7: R58.2 R73.1 R180.1 R184.2
I2C2_SCL: R69.1
I2C2_SDA: R66.1
PS_HRN_EXC0: R29.1 R30.1
PS_HRN_EXC1: R31.1 R32.1
PS_HRN_EXC2: R33.1 R34.1
PS_HRN_EXC3: R35.1 R36.1
PS_HRN_EXC4: R45.1 R46.1
PS_HRN_EXC5: R47.1 R48.1
PS_HRN_EXC6: R49.1 R50.1
PS_HRN_EXC7: R51.1 R52.1 R64.2
PS_HRN_IN0: R37.1 R173.1
PS_HRN_IN1: R38.1 R174.1
PS_HRN_IN2: R39.1 R175.1
PS_HRN_IN3: R40.1 R176.1
PS_HRN_IN4: R53.1 R181.1
PS_HRN_IN5: R54.1 R182.1
PS_HRN_IN6: R55.1 R183.1
PS_HRN_IN7: R56.1 R67.2 R184.1
NetP10_1: P10.1 R64.1
NetP10_2: P10.2 R67.1
NetR37_2: R37.2 R169.2
NetR38_2: R38.2 R170.2
NetR39_2: R39.2 R171.2
NetR40_2: R40.2 R172.2
NetR53_2: R53.2 R177.2
NetR54_2: R54.2 R178.2
NetR55_2: R55.2 R179.2
NetR56_2: R56.2 R180.2
NetR61_1: R61.1 R75.2 U4.13(A1)
NetR62_1: R62.1 R76.2 U4.12(A0)
NetR63_2: R63.2 U4.1(CH0)
NetR65_2: R65.2 U4.2(CH1)
NetR66_2: R66.2 U4.15(SDA)
NetR68_2: R68.2 U4.3(CH2)
NetR69_2: R69.2 U4.14(SCL)
NetR70_2: R70.2 U4.4(CH3)
NetR71_2: R71.2 U4.5(CH4)
NetR72_2: R72.2 U4.6(CH5)
NetR73_2: R73.2 U4.7(CH6)
NetR74_2: R74.2 U4.8(CH7)

Not connected (* = marked no-connect by the designer): U4 11(COM)

### Notes on the sheet
- Pressure Sensor Circuits
- (near R181) Connect jumper between 1 & 2 for voltage output, 2 & 3 for current output.
  Adjust resistor values for actual sensor output
- (near C10) PCB: Place bypass cap near ADC
- Testing: Connect PS directly to P?
- Pressure Sensor ADC
- Design: Expected I2C Address 0x48
- Title
- Size:
- Date:
- A4
- Number:
- Time:
- Revision:
- Sheet
- of
- File:

### Library data of the parts
C10 = GRM21BR60J475KA11L: CAP CER 4.7UF 6.3V X5R 0805; Manufacturer: Murata Electronics North America; Factory Stock: 0; Unit Price (USD): 0.28; Minimum Quantity: 1; Tolerance: ±10%; Datasheets: http://www.murata.com/~/media/webrenewal/support/library/catalog/products/capacitor/mlcc/c02e.pdf; Image: //media.digikey.com/Renders/Murata%20Renders/0805%20(2012%20Metric)%20.85mm.jpg; Digi-Key Part Number: 490-9749-1-ND; Part Number: GRM21BR60J475KA11L; Quantity Available: 2821; @ qty: 0; Packaging: Cut Tape (CT); Series: GRM; Part Status: Active; Value: 4.7µF; Voltage: 6.3V; Temperature Coefficient: X5R; Operating Temperature: -55°C ~ 85°C; Features: -; Ratings: -; Applications: General Purpose; Mounting Type: Surface Mount, MLCC; Package / Case: 0805 (2012 Metric); Size / Dimension: 0.079" L x 0.049" W (2.00mm x 1.25mm); Height - Seated (Max): -; Thickness (Max): 0.055" (1.40mm); Lead Spacing: -; Lead Style: -
P10 = Header 3: Header, 3-Pin; LatestRevisionDate: 17-Jul-2002; LatestRevisionNote: Re-released for DXP Platform.; Publisher: Altium Limited
R13#2 R14#2 R41-R44 R57 R58 = ERJ-2GEJ151X: RES SMD 150 OHM 5% 1/10W 0402; Manufacturer: Panasonic Electronic Components; Factory Stock: 0; Unit Price (USD): 0.00350; @ qty: 1500; Minimum Quantity: 1; Power (Watts): 0.1W, 1/10W; Temperature Coefficient: ±200ppm/°C; Part Number: ERJ-2GEJ151X; Datasheets: http://industrial.panasonic.com/www-cgi/jvcr13pz.cgi?E+PZ+3+AOA0001+ERJ2GEJ151X+7+WW; Image: //media.digikey.com/Photos/Panasonic%20Photos/ERJ-PA2-Series.jpg; Digi-Key Part Number: P150JCT-ND; Quantity Available: 303213; Packaging: Cut Tape (CT); Series: ERJ; Part Status: Active; Value: 150; Tolerance: ±5%; Composition: Thick Film; Features: Automotive AEC-Q200; Operating Temperature: -55°C ~ 155°C; Package / Case: 0402 (1005 Metric); Supplier Device Package: 0402; Size / Dimension: 0.039" L x 0.020" W (1.00mm x 0.50mm); Height - Seated (Max): 0.016" (0.40mm); Number of Terminations: 2; Failure Rate: -
R29-R36 R45-R52 R61 R62 R64 R66 R67 R69 R75 R76 R169-R184 = ERJ-2GE0R00X: as R23 on sheet lv_io_main_connector; Part Number: ERJ-2GE0R00X; Datasheets: http://industrial.panasonic.com/www-cgi/jvcr13pz.cgi?E+PZ+3+AOA0001+ERJ2GE0R00X+7+WW; Image: //media.digikey.com/Photos/Panasonic%20Photos/ERJ-PA2-Series.jpg; Digi-Key Part Number: P0.0JCT-ND; Quantity Available: 3152483; Packaging: Cut Tape (CT); Series: ERJ; Part Status: Active; Value: 0.0; Tolerance: Jumper; Composition: Thick Film; Features: Automotive AEC-Q200; Temperature Coefficient: -; Operating Temperature: -55°C ~ 155°C; Package / Case: 0402 (1005 Metric); Supplier Device Package: 0402; Size / Dimension: 0.039" L x 0.020" W (1.00mm x 0.50mm); Height - Seated (Max): 0.016" (0.40mm); Number of Terminations: 2; Failure Rate: -
  R61 R62 R64 R67: DNP: DNP
R37-R40 R53-R56 = ERJ-2GEJ101X: RES SMD 100 OHM 5% 1/10W 0402; Manufacturer: Panasonic Electronic Components; Factory Stock: 0; Unit Price (USD): 0.00350; @ qty: 1500; Minimum Quantity: 1; Power (Watts): 0.1W, 1/10W; Temperature Coefficient: ±200ppm/°C; Part Number: ERJ-2GEJ101X; Datasheets: http://industrial.panasonic.com/www-cgi/jvcr13pz.cgi?E+PZ+3+AOA0001+ERJ2GEJ101X+7+WW; Image: //media.digikey.com/Photos/Panasonic%20Photos/ERJ-PA2-Series.jpg; Digi-Key Part Number: P100JCT-ND; Quantity Available: 3114113; Packaging: Cut Tape (CT); Series: ERJ; Part Status: Active; Value: 100; Tolerance: ±5%; Composition: Thick Film; Features: Automotive AEC-Q200; Operating Temperature: -55°C ~ 155°C; Package / Case: 0402 (1005 Metric); Supplier Device Package: 0402; Size / Dimension: 0.039" L x 0.020" W (1.00mm x 0.50mm); Height - Seated (Max): 0.016" (0.40mm); Number of Terminations: 2; Failure Rate: -
R63 R65 R68 R70-R74 = PRG18BB470MB1RB: PTC RESET FUSE 6V 330MA 0603; Manufacturer P/N: PRG18BC1R0MM1RB; Manufacturer: Murata; Factory Stock: 0; Unit Price (USD): 0.10080; @ qty: 1500; Tolerance: ±1%; Power (Watts): 0.167W, 1/6W; Temperature Coefficient: ±250ppm/°C; Digikey Link: https://www.digikey.com/product-detail/en/murata-electronics-north-america/PRG18BC1R0MM1RB/490-8505-1-ND/4380768; Image: //media.digikey.com/Photos/Panasonic%20Photos/ERJ-PA2-Series.jpg; Digi-Key Part Number: 490-8505-1-ND; Quantity Available: 14922; Minimum Quantity: 1; Packaging: Cut Tape (CT); Part Status: Active; Value: 1; Composition: Thick Film; Operating Temperature: -55°C ~ 125°C; Package / Case: 0603; Supplier Device Package: 0402; Size / Dimension: 0.039" L x 0.020" W (1.00mm x 0.50mm); Height - Seated (Max): 0.016" (0.40mm); Number of Terminations: 2; Failure Rate: -
U4 = NCD9830DBR2G: IC ADC 8BIT 8CH I2C 16TSSOP; Manufacturer: ON Semiconductor; Digikey P/N: NCD9830DBR2GOSCT-ND; Digikey Link: https://www.digikey.com/product-detail/en/on-semiconductor/NCD9830DBR2G/NCD9830DBR2GOSCT-ND/9086945; Cost: 2.70; Manufacturer P/N: NCD9830DBR2G

## Sheet lv_io_solenoid_ctl.SchDoc
size A4; Organization: Badgerloop; Address1: 133 Engineering Research; Address2: Building; Address3: Madison, WI 53715
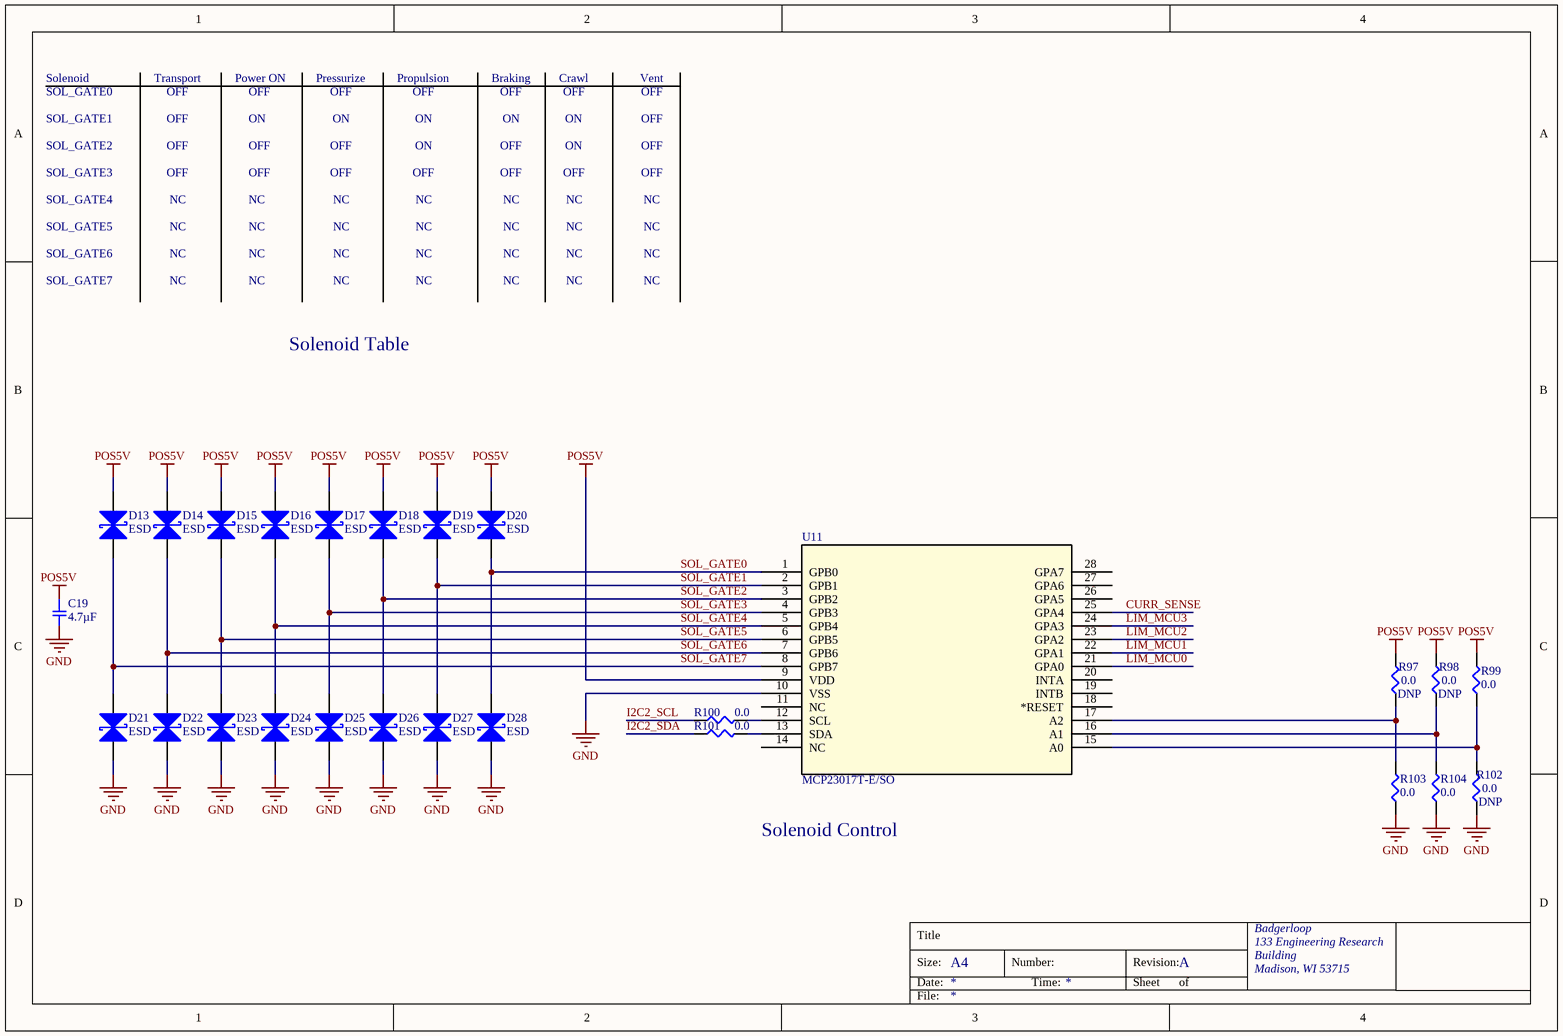
[diagram p5: lv_io_solenoid_ctl.SchDoc]

### Parts
C19  4.7µF  [SMD-0805C]
D13  ESD  [SMD-0402-RES]
D14  ESD  [SMD-0402-RES]
D15  ESD  [SMD-0402-RES]
D16  ESD  [SMD-0402-RES]
D17  ESD  [SMD-0402-RES]
D18  ESD  [SMD-0402-RES]
D19  ESD  [SMD-0402-RES]
D20  ESD  [SMD-0402-RES]
D21  ESD  [SMD-0402-RES]
D22  ESD  [SMD-0402-RES]
D23  ESD  [SMD-0402-RES]
D24  ESD  [SMD-0402-RES]
D25  ESD  [SMD-0402-RES]
D26  ESD  [SMD-0402-RES]
D27  ESD  [SMD-0402-RES]
D28  ESD  [SMD-0402-RES]
R97  0.0  [SMD-0402-RES]
R98  0.0  [SMD-0402-RES]
R99  0.0  [SMD-0402-RES]
R100  0.0  [SMD-0402-RES]
R101  0.0  [SMD-0402-RES]
R102  0.0  [SMD-0402-RES]
R103  0.0  [SMD-0402-RES]
R104  0.0  [SMD-0402-RES]
U11  MCP23017T-E/SO  [SOIC28-W_MC-M]

### Nets
GND: C19.2 D21.1(A) D22.1(A) D23.1(A) D24.1(A) D25.1(A) D26.1(A) D27.1(A) D28.1(A) R102.1 R103.1 R104.1 U11.10(VSS)
POS5V: C19.1 D13.2(K) D14.2(K) D15.2(K) D16.2(K) D17.2(K) D18.2(K) D19.2(K) D20.2(K) R97.2 R98.2 R99.2 U11.9(VDD)
CURR_SENSE: U11.25(GPA4)
I2C2_SCL: R100.1
I2C2_SDA: R101.1
LIM_MCU0: U11.21(GPA0)
LIM_MCU1: U11.22(GPA1)
LIM_MCU2: U11.23(GPA2)
LIM_MCU3: U11.24(GPA3)
SOL_GATE0: D20.1(A) D28.2(K) U11.1(GPB0)
SOL_GATE1: D19.1(A) D27.2(K) U11.2(GPB1)
SOL_GATE2: D18.1(A) D26.2(K) U11.3(GPB2)
SOL_GATE3: D17.1(A) D25.2(K) U11.4(GPB3)
SOL_GATE4: D16.1(A) D24.2(K) U11.5(GPB4)
SOL_GATE5: D15.1(A) D23.2(K) U11.6(GPB5)
SOL_GATE6: D14.1(A) D22.2(K) U11.7(GPB6)
SOL_GATE7: D13.1(A) D21.2(K) U11.8(GPB7)
NetR97_1: R97.1 R103.2 U11.17(A2)
NetR98_1: R98.1 R104.2 U11.16(A1)
NetR99_1: R99.1 R102.2 U11.15(A0)
NetR100_2: R100.2 U11.12(SCL)
NetR101_2: R101.2 U11.13(SDA)

Not connected (* = marked no-connect by the designer): U11 11(NC) 14(NC) 18(*RESET) 19(INTB) 20(INTA) 26(GPA5) 27(GPA6) 28(GPA7)

### Notes on the sheet
- SOL_GATE0
- Solenoid
- Transport
- OFF
- Power ON
- Pressurize
- Propulsion
- Braking
- Crawl
- Vent
- SOL_GATE1
- SOL_GATE2
- SOL_GATE3
- ON
- SOL_GATE4
- SOL_GATE5
- NC
- SOL_GATE6
- SOL_GATE7
- Solenoid Table
- Solenoid Control
- Title
- Size:
- Date:
- A4
- Number:
- Time:
- Revision:
- Sheet
- of
- File:

### Library data of the parts
C19 = GRM21BR60J475KA11L: as C10 on sheet lv_io_pressure; Datasheets: http://www.murata.com/~/media/webrenewal/support/library/catalog/products/capacitor/mlcc/c02e.pdf; Image: //media.digikey.com/Renders/Murata%20Renders/0805%20(2012%20Metric)%20.85mm.jpg; Digi-Key Part Number: 490-9749-1-ND; Part Number: GRM21BR60J475KA11L; Quantity Available: 2821; @ qty: 0; Packaging: Cut Tape (CT); Series: GRM; Part Status: Active; Value: 4.7µF; Voltage: 6.3V; Temperature Coefficient: X5R; Operating Temperature: -55°C ~ 85°C; Features: -; Ratings: -; Applications: General Purpose; Mounting Type: Surface Mount, MLCC; Package / Case: 0805 (2012 Metric); Size / Dimension: 0.079" L x 0.049" W (2.00mm x 1.25mm); Height - Seated (Max): -; Thickness (Max): 0.055" (1.40mm); Lead Spacing: -; Lead Style: -
D13-D28 = ESD Diode: as D2 on sheet lv_io_retro; Digikey P/N: P13571CT-ND; Digikey Link: https://www.digikey.com/product-detail/en/panasonic-electronic-components/EZA-EG2A50AX/P13571CT-ND/1137239
R97-R104 = ERJ-2GE0R00X: as R23 on sheet lv_io_main_connector; Part Number: ERJ-2GE0R00X; Datasheets: http://industrial.panasonic.com/www-cgi/jvcr13pz.cgi?E+PZ+3+AOA0001+ERJ2GE0R00X+7+WW; Image: //media.digikey.com/Photos/Panasonic%20Photos/ERJ-PA2-Series.jpg; Digi-Key Part Number: P0.0JCT-ND; Quantity Available: 3152483; Packaging: Cut Tape (CT); Series: ERJ; Part Status: Active; Value: 0.0; Tolerance: Jumper; Composition: Thick Film; Features: Automotive AEC-Q200; Temperature Coefficient: -; Operating Temperature: -55°C ~ 155°C; Package / Case: 0402 (1005 Metric); Supplier Device Package: 0402; Size / Dimension: 0.039" L x 0.020" W (1.00mm x 0.50mm); Height - Seated (Max): 0.016" (0.40mm); Number of Terminations: 2; Failure Rate: -
  R97 R98 R102: DNP: DNP
  R99 R103 R104: DNP: *
U11 = MCP23017T-E/SO: IC I/O EXPANDER I2C 16B 28SOIC; Manufacturer: Microchip; Manufacturer P/N: MCP23017T-E/SO; Digikey P/N: MCP23017T-E/SOCT-ND; Digikey Link: https://www.digikey.com/product-detail/en/microchip-technology/MCP23017T-E-SO/MCP23017T-E-SOCT-ND/5358289

## Sheet lv_io_solenoid_drv.SchDoc
size A4; Organization: Badgerloop; Address1: 133 Engineering Research; Address2: Building; Address3: Madison, WI 53715
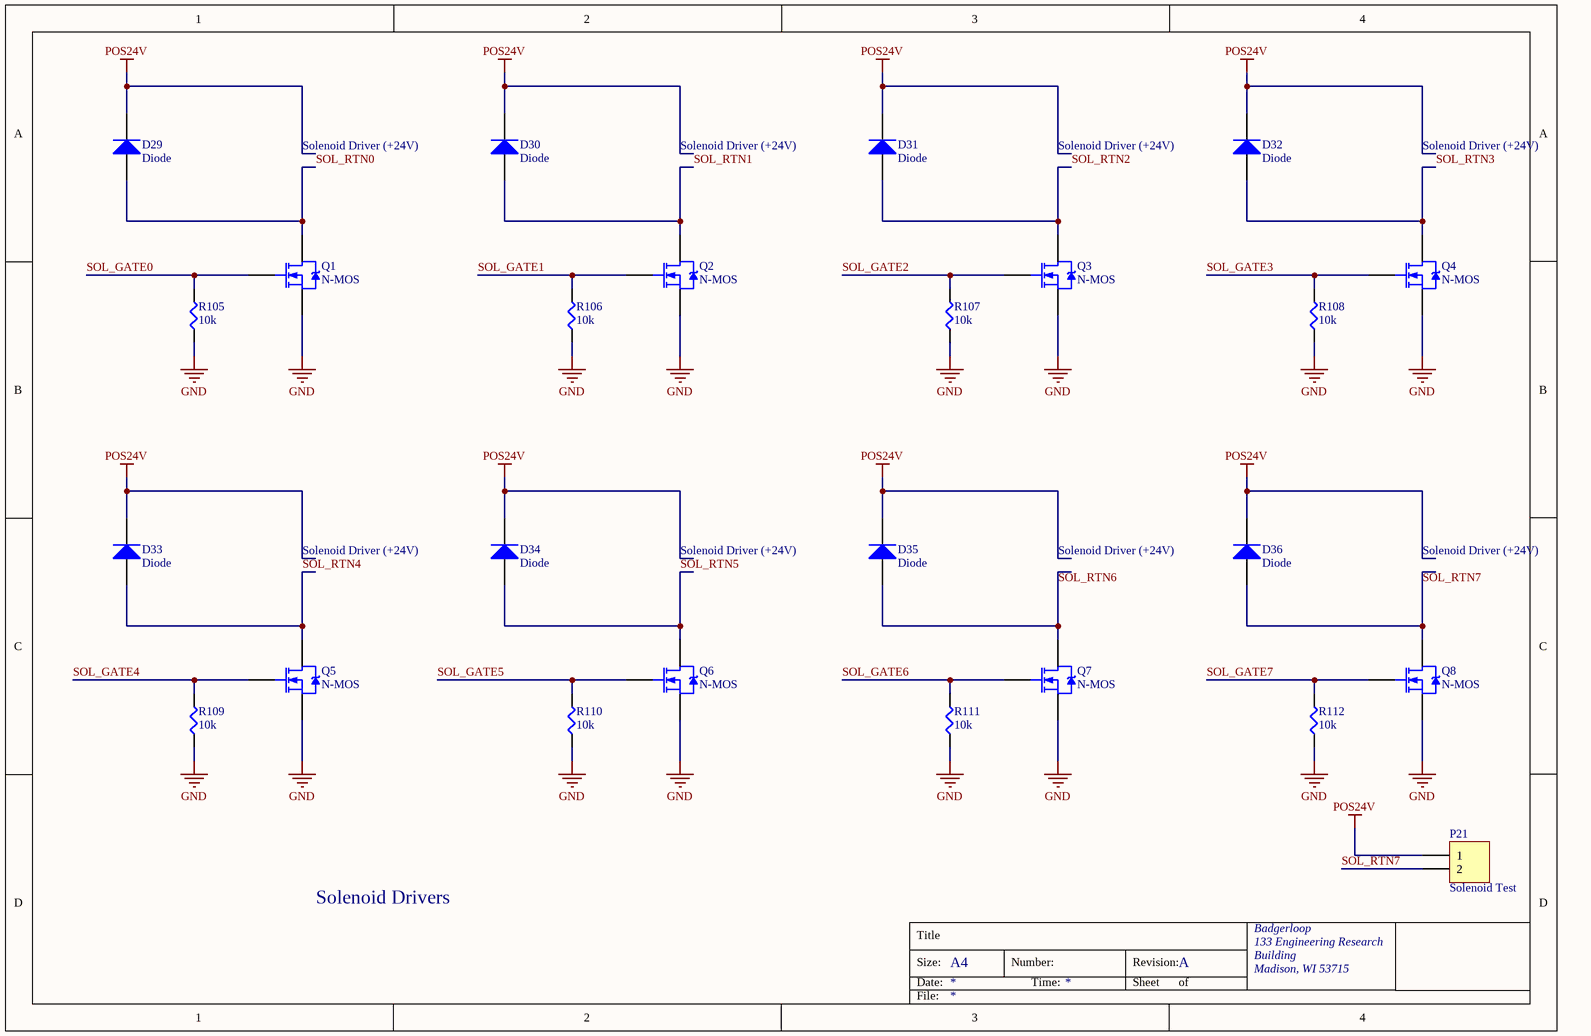
[diagram p6: lv_io_solenoid_drv.SchDoc]

### Parts
D29  Diode  [SODFL360X110-2N]
D30  Diode  [SODFL360X110-2N]
D31  Diode  [SODFL360X110-2N]
D32  Diode  [SODFL360X110-2N]
D33  Diode  [SODFL360X110-2N]
D34  Diode  [SODFL360X110-2N]
D35  Diode  [SODFL360X110-2N]
D36  Diode  [SODFL360X110-2N]
P21  Solenoid Test  [Pin Header 1x2 TH Pitch 2.54mm]
Q1  N-MOS  [DPAK228P991X238-3N]
Q2  N-MOS  [DPAK228P991X238-3N]
Q3  N-MOS  [DPAK228P991X238-3N]
Q4  N-MOS  [DPAK228P991X238-3N]
Q5  N-MOS  [DPAK228P991X238-3N]
Q6  N-MOS  [DPAK228P991X238-3N]
Q7  N-MOS  [DPAK228P991X238-3N]
Q8  N-MOS  [DPAK228P991X238-3N]
R105  10k  [SMD-0402-RES]
R106  10k  [SMD-0402-RES]
R107  10k  [SMD-0402-RES]
R108  10k  [SMD-0402-RES]
R109  10k  [SMD-0402-RES]
R110  10k  [SMD-0402-RES]
R111  10k  [SMD-0402-RES]
R112  10k  [SMD-0402-RES]

### Nets
GND: Q1.3(S) Q2.3(S) Q3.3(S) Q4.3(S) Q5.3(S) Q6.3(S) Q7.3(S) Q8.3(S) R105.1 R106.1 R107.1 R108.1 R109.1 R110.1 R111.1 R112.1
POS24V: D29.2(K) D30.2(K) D31.2(K) D32.2(K) D33.2(K) D34.2(K) D35.2(K) D36.2(K) P21.1
SOL_GATE0: Q1.1(G) R105.2
SOL_GATE1: Q2.1(G) R106.2
SOL_GATE2: Q3.1(G) R107.2
SOL_GATE3: Q4.1(G) R108.2
SOL_GATE4: Q5.1(G) R109.2
SOL_GATE5: Q6.1(G) R110.2
SOL_GATE6: Q7.1(G) R111.2
SOL_GATE7: Q8.1(G) R112.2
SOL_RTN0: D29.1(A) Q1.4(D)
SOL_RTN1: D30.1(A) Q2.4(D)
SOL_RTN2: D31.1(A) Q3.4(D)
SOL_RTN3: D32.1(A) Q4.4(D)
SOL_RTN4: D33.1(A) Q5.4(D)
SOL_RTN5: D34.1(A) Q6.4(D)
SOL_RTN6: D35.1(A) Q7.4(D)
SOL_RTN7: D36.1(A) P21.2 Q8.4(D)

### Notes on the sheet
- Solenoid Driver (+24V)
- Solenoid Drivers
- Title
- Size:
- Date:
- A4
- Number:
- Time:
- Revision:
- Sheet
- of
- File:

### Library data of the parts
D29-D36 = DIODE STD: DIODE GEN PURP 200V 2A SOD123FL; Manufacturer: ON SEMI; Manufacturer P/N: NHP220SFT3G; Digikey Link: https://www.digikey.com/product-detail/en/on-semiconductor/NHP220SFT3G/NHP220SFT3GOSCT-ND/5801747; Digikey P/N: NHP220SFT3GOSCT-ND
P21 = Header 2: Header, 2-Pin; LatestRevisionDate: 17-Jul-2002; LatestRevisionNote: Re-released for DXP Platform.; Publisher: Altium Limited
Q1-Q8 = N-MOS: N-Channel Power MOSFET, 12 A, 60 V; Manufacturer: ON SEMI; Manufacturer P/N: NTD3055L104T4G; Digikey Link: https://www.digikey.com/product-detail/en/on-semiconductor/NTD3055L104T4G/NTD3055L104T4GOSDKR-ND/1749196; Digikey P/N: NTD3055L104T4GOSDKR-ND
R105-R112 = ERJ-2RHD1002X: RES SMD 10K OHM 0.5% 1/16W 0402; Manufacturer: Panasonic Electronic Components; Factory Stock: 0; Unit Price (USD): 0.01767; @ qty: 1500; Minimum Quantity: 1; Power (Watts): 0.063W, 1/16W; Temperature Coefficient: ±50ppm/°C; Part Number: ERJ-2RHD1002X; Datasheets: http://industrial.panasonic.com/www-cgi/jvcr13pz.cgi?E+PZ+3+AOA0001+ERJ2RHD1002X+8+WW; Image: //media.digikey.com/Photos/Panasonic%20Photos/ERJ-PA2-Series.jpg; Digi-Key Part Number: P15984CT-ND; Quantity Available: 67996; Packaging: Cut Tape (CT); Series: ERJ; Part Status: Active; Value: 10k; Tolerance: ±0.5%; Composition: Thick Film; Features: Automotive AEC-Q200; Operating Temperature: -55°C ~ 125°C; Package / Case: 0402 (1005 Metric); Supplier Device Package: 0402; Size / Dimension: 0.039" L x 0.020" W (1.00mm x 0.50mm); Height - Seated (Max): 0.016" (0.40mm); Number of Terminations: 2; Failure Rate: -

## Sheet lv_io_analog_input.SchDoc
size A4; Organization: Badgerloop; Address1: 133 Engineering Research; Address2: Building; Address3: Madison, WI 53715
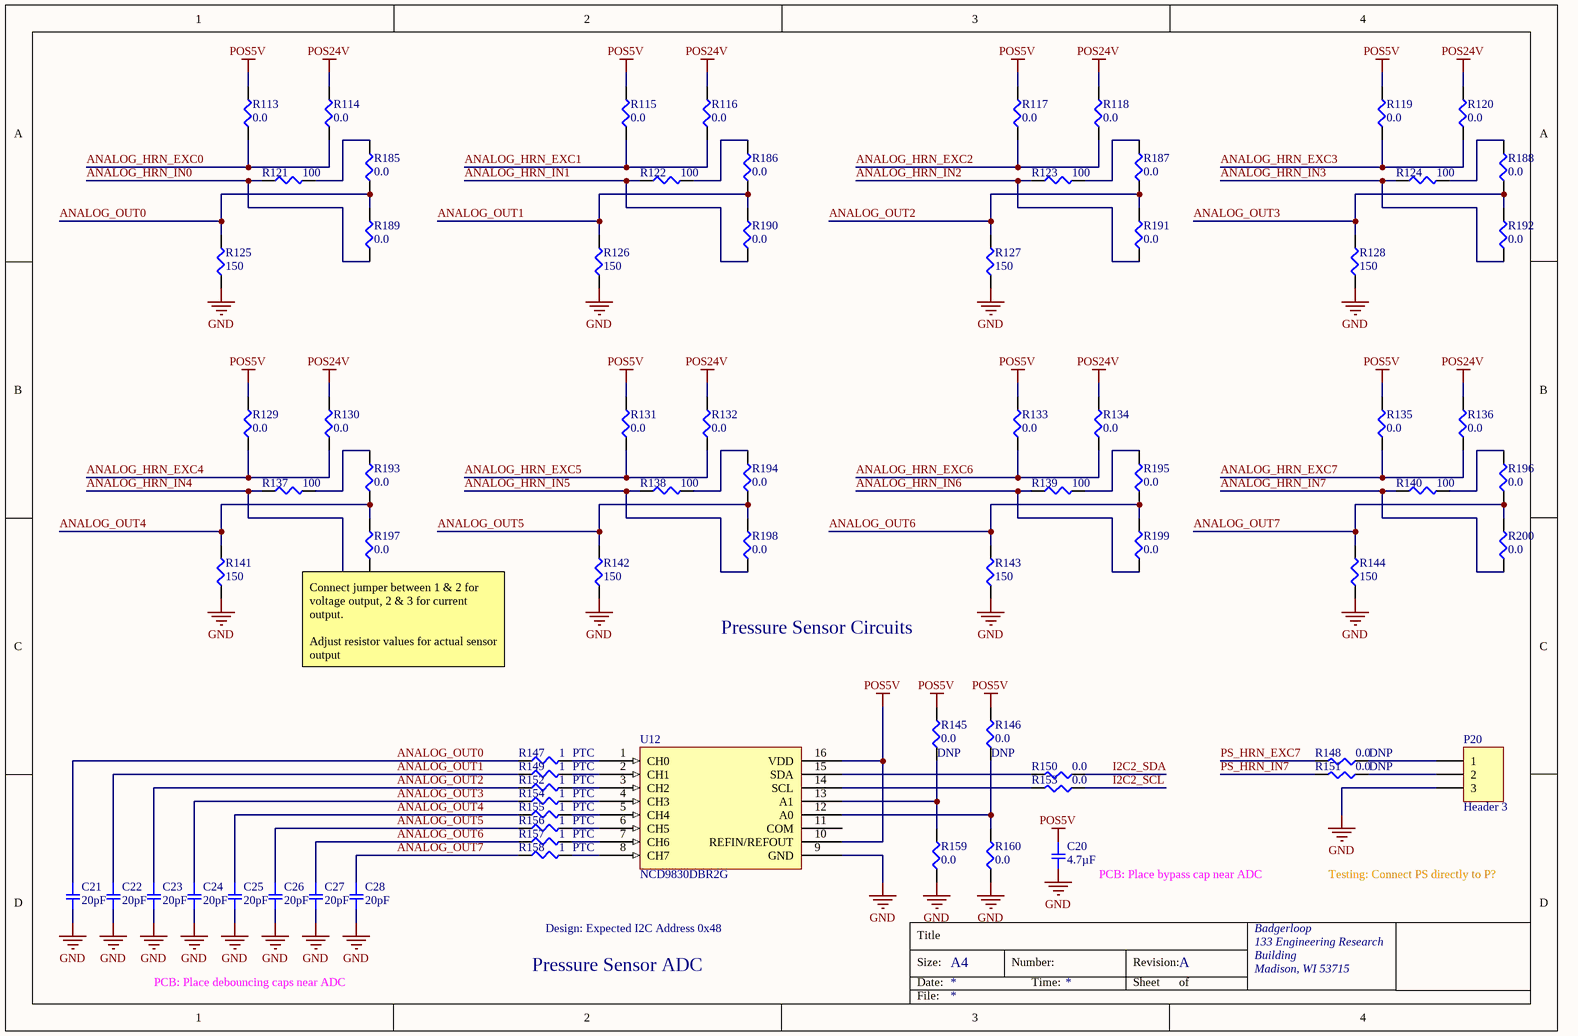
[diagram p7: lv_io_analog_input.SchDoc]

### Parts
C20  4.7µF  [SMD-0805C]
C21  20pF  [SMD-0402C]
C22  20pF  [SMD-0402C]
C23  20pF  [SMD-0402C]
C24  20pF  [SMD-0402C]
C25  20pF  [SMD-0402C]
C26  20pF  [SMD-0402C]
C27  20pF  [SMD-0402C]
C28  20pF  [SMD-0402C]
P20  Header 3  [Pin Header 1x3 TH Pitch 2.54mm]
R113  0.0  [SMD-0402-RES]
R114  0.0  [SMD-0402-RES]
R115  0.0  [SMD-0402-RES]
R116  0.0  [SMD-0402-RES]
R117  0.0  [SMD-0402-RES]
R118  0.0  [SMD-0402-RES]
R119  0.0  [SMD-0402-RES]
R120  0.0  [SMD-0402-RES]
R121  100  [SMD-0402-RES]
R122  100  [SMD-0402-RES]
R123  100  [SMD-0402-RES]
R124  100  [SMD-0402-RES]
R125  150  [SMD-0603-RES]
R126  150  [SMD-0603-RES]
R127  150  [SMD-0603-RES]
R128  150  [SMD-0603-RES]
R129  0.0  [SMD-0402-RES]
R130  0.0  [SMD-0402-RES]
R131  0.0  [SMD-0402-RES]
R132  0.0  [SMD-0402-RES]
R133  0.0  [SMD-0402-RES]
R134  0.0  [SMD-0402-RES]
R135  0.0  [SMD-0402-RES]
R136  0.0  [SMD-0402-RES]
R137  100  [SMD-0402-RES]
R138  100  [SMD-0402-RES]
R139  100  [SMD-0402-RES]
R140  100  [SMD-0402-RES]
R141  150  [SMD-0603-RES]
R142  150  [SMD-0603-RES]
R143  150  [SMD-0603-RES]
R144  150  [SMD-0603-RES]
R145  0.0  [SMD-0402-RES]
R146  0.0  [SMD-0402-RES]
R147  1  Features: PTC  [SMD-0603-RES]
R148  0.0  [SMD-0402-RES]
R149  1  Features: PTC  [SMD-0603-RES]
R150  0.0  [SMD-0402-RES]
R151  0.0  [SMD-0402-RES]
R152  1  Features: PTC  [SMD-0603-RES]
R153  0.0  [SMD-0402-RES]
R154  1  Features: PTC  [SMD-0603-RES]
R155  1  Features: PTC  [SMD-0603-RES]
R156  1  Features: PTC  [SMD-0603-RES]
R157  1  Features: PTC  [SMD-0603-RES]
R158  1  Features: PTC  [SMD-0603-RES]
R159  0.0  [SMD-0402-RES]
R160  0.0  [SMD-0402-RES]
R185  0.0  [SMD-0402-RES]
R186  0.0  [SMD-0402-RES]
R187  0.0  [SMD-0402-RES]
R188  0.0  [SMD-0402-RES]
R189  0.0  [SMD-0402-RES]
R190  0.0  [SMD-0402-RES]
R191  0.0  [SMD-0402-RES]
R192  0.0  [SMD-0402-RES]
R193  0.0  [SMD-0402-RES]
R194  0.0  [SMD-0402-RES]
R195  0.0  [SMD-0402-RES]
R196  0.0  [SMD-0402-RES]
R197  0.0  [SMD-0402-RES]
R198  0.0  [SMD-0402-RES]
R199  0.0  [SMD-0402-RES]
R200  0.0  [SMD-0402-RES]
U12  NCD9830DBR2G  [TSOP65P640X120_HS-17N]

### Nets
GND: C20.2 C21.2 C22.2 C23.2 C24.2 C25.2 C26.2 C27.2 C28.2 P20.3 R125.1 R126.1 R127.1 R128.1 R141.1 R142.1 R143.1 R144.1 R159.1 R160.1 U12.9(GND)
POS5V: C20.1 R113.2 R115.2 R117.2 R119.2 R129.2 R131.2 R133.2 R135.2 R145.2 R146.2 U12.10(REFIN/REFOUT) U12.16(VDD)
POS24V: R114.2 R116.2 R118.2 R120.2 R130.2 R132.2 R134.2 R136.2
ANALOG_HRN_EXC0: R113.1 R114.1
ANALOG_HRN_EXC1: R115.1 R116.1
ANALOG_HRN_EXC2: R117.1 R118.1
ANALOG_HRN_EXC3: R119.1 R120.1
ANALOG_HRN_EXC4: R129.1 R130.1
ANALOG_HRN_EXC5: R131.1 R132.1
ANALOG_HRN_EXC6: R133.1 R134.1
ANALOG_HRN_EXC7: R135.1 R136.1
ANALOG_HRN_IN0: R121.1 R189.1
ANALOG_HRN_IN1: R122.1 R190.1
ANALOG_HRN_IN2: R123.1 R191.1
ANALOG_HRN_IN3: R124.1 R192.1
ANALOG_HRN_IN4: R137.1 R197.1
ANALOG_HRN_IN5: R138.1 R198.1
ANALOG_HRN_IN6: R139.1 R199.1
ANALOG_HRN_IN7: R140.1 R200.1
ANALOG_OUT0: C21.1 R125.2 R147.1 R185.1 R189.2
ANALOG_OUT1: C22.1 R126.2 R149.1 R186.1 R190.2
ANALOG_OUT2: C23.1 R127.2 R152.1 R187.1 R191.2
ANALOG_OUT3: C24.1 R128.2 R154.1 R188.1 R192.2
ANALOG_OUT4: C25.1 R141.2 R155.1 R193.1 R197.2
ANALOG_OUT5: C26.1 R142.2 R156.1 R194.1 R198.2
ANALOG_OUT6: C27.1 R143.2 R157.1 R195.1 R199.2
ANALOG_OUT7: C28.1 R144.2 R158.1 R196.1 R200.2
I2C2_SCL: R153.1
I2C2_SDA: R150.1
PS_HRN_EXC7: R148.2
PS_HRN_IN7: R151.2
NetP20_1: P20.1 R148.1
NetP20_2: P20.2 R151.1
NetR121_2: R121.2 R185.2
NetR122_2: R122.2 R186.2
NetR123_2: R123.2 R187.2
NetR124_2: R124.2 R188.2
NetR137_2: R137.2 R193.2
NetR138_2: R138.2 R194.2
NetR139_2: R139.2 R195.2
NetR140_2: R140.2 R196.2
NetR145_1: R145.1 R159.2 U12.13(A1)
NetR146_1: R146.1 R160.2 U12.12(A0)
NetR147_2: R147.2 U12.1(CH0)
NetR149_2: R149.2 U12.2(CH1)
NetR150_2: R150.2 U12.15(SDA)
NetR152_2: R152.2 U12.3(CH2)
NetR153_2: R153.2 U12.14(SCL)
NetR154_2: R154.2 U12.4(CH3)
NetR155_2: R155.2 U12.5(CH4)
NetR156_2: R156.2 U12.6(CH5)
NetR157_2: R157.2 U12.7(CH6)
NetR158_2: R158.2 U12.8(CH7)

Not connected (* = marked no-connect by the designer): U12 11(COM)

### Notes on the sheet
- Pressure Sensor Circuits
- (near R197) Connect jumper between 1 & 2 for voltage output, 2 & 3 for current output.
  Adjust resistor values for actual sensor output
- (near C20) PCB: Place bypass cap near ADC
- Testing: Connect PS directly to P?
- PCB: Place debouncing caps near ADC
- Pressure Sensor ADC
- Design: Expected I2C Address 0x48
- Title
- Size:
- Date:
- A4
- Number:
- Time:
- Revision:
- Sheet
- of
- File:

### Library data of the parts
C20 = GRM21BR60J475KA11L: as C10 on sheet lv_io_pressure; Datasheets: http://www.murata.com/~/media/webrenewal/support/library/catalog/products/capacitor/mlcc/c02e.pdf; Image: //media.digikey.com/Renders/Murata%20Renders/0805%20(2012%20Metric)%20.85mm.jpg; Digi-Key Part Number: 490-9749-1-ND; Part Number: GRM21BR60J475KA11L; Quantity Available: 2821; @ qty: 0; Packaging: Cut Tape (CT); Series: GRM; Part Status: Active; Value: 4.7µF; Voltage: 6.3V; Temperature Coefficient: X5R; Operating Temperature: -55°C ~ 85°C; Features: -; Ratings: -; Applications: General Purpose; Mounting Type: Surface Mount, MLCC; Package / Case: 0805 (2012 Metric); Size / Dimension: 0.079" L x 0.049" W (2.00mm x 1.25mm); Height - Seated (Max): -; Thickness (Max): 0.055" (1.40mm); Lead Spacing: -; Lead Style: -
C21-C28 = GJM1555C1H200JB01D: CAP CER 20PF 50V NP0 0402; Manufacturer: Murata Electronics North America; Factory Stock: 0; Unit Price (USD): 0.1; Minimum Quantity: 1; Tolerance: ±5%; Temperature Coefficient: C0G, NP0; Datasheets: http://www.murata.com/~/media/webrenewal/support/library/catalog/products/capacitor/mlcc/c02e.pdf; Image: //media.digikey.com/Renders/Murata%20Renders/ZRB-SERIES-0402.jpg; Digi-Key Part Number: 490-3120-1-ND; Part Number: GJM1555C1H200JB01D; Quantity Available: 13133; @ qty: 0; Packaging: Cut Tape (CT); Series: GJM; Part Status: Active; Value: 20pF; Voltage: 50V; Operating Temperature: -55°C ~ 125°C; Features: High Q, Low Loss; Ratings: -; Applications: RF, Microwave, High Frequency; Mounting Type: Surface Mount, MLCC; Package / Case: 0402 (1005 Metric); Size / Dimension: 0.039" L x 0.020" W (1.00mm x 0.50mm); Height - Seated (Max): -; Thickness (Max): 0.022" (0.55mm); Lead Spacing: -; Lead Style: -
P20 = Header 3: Header, 3-Pin; LatestRevisionDate: 17-Jul-2002; LatestRevisionNote: Re-released for DXP Platform.; Publisher: Altium Limited
R113-R120 R129-R136 R145 R146 R148 R150 R151 R153 R159 R160 R185-R200 = ERJ-2GE0R00X: as R23 on sheet lv_io_main_connector; Part Number: ERJ-2GE0R00X; Datasheets: http://industrial.panasonic.com/www-cgi/jvcr13pz.cgi?E+PZ+3+AOA0001+ERJ2GE0R00X+7+WW; Image: //media.digikey.com/Photos/Panasonic%20Photos/ERJ-PA2-Series.jpg; Digi-Key Part Number: P0.0JCT-ND; Quantity Available: 3152483; Packaging: Cut Tape (CT); Series: ERJ; Part Status: Active; Value: 0.0; Tolerance: Jumper; Composition: Thick Film; Features: Automotive AEC-Q200; Temperature Coefficient: -; Operating Temperature: -55°C ~ 155°C; Package / Case: 0402 (1005 Metric); Supplier Device Package: 0402; Size / Dimension: 0.039" L x 0.020" W (1.00mm x 0.50mm); Height - Seated (Max): 0.016" (0.40mm); Number of Terminations: 2; Failure Rate: -
  R145 R146 R148 R151: DNP: DNP
R121-R124 R137-R140 = ERJ-2GEJ101X: as R37 on sheet lv_io_pressure; Part Number: ERJ-2GEJ101X; Datasheets: http://industrial.panasonic.com/www-cgi/jvcr13pz.cgi?E+PZ+3+AOA0001+ERJ2GEJ101X+7+WW; Image: //media.digikey.com/Photos/Panasonic%20Photos/ERJ-PA2-Series.jpg; Digi-Key Part Number: P100JCT-ND; Quantity Available: 3114113; Packaging: Cut Tape (CT); Series: ERJ; Part Status: Active; Value: 100; Tolerance: ±5%; Composition: Thick Film; Features: Automotive AEC-Q200; Operating Temperature: -55°C ~ 155°C; Package / Case: 0402 (1005 Metric); Supplier Device Package: 0402; Size / Dimension: 0.039" L x 0.020" W (1.00mm x 0.50mm); Height - Seated (Max): 0.016" (0.40mm); Number of Terminations: 2; Failure Rate: -
R125-R128 R141-R144 = ERJ-P03D1500V: RES SMD 150 OHM 0.5% 1/5W 0603; Manufacturer: Panasonic Electronic Components; Factory Stock: 0; Unit Price (USD): 0.06582; @ qty: 1500; Minimum Quantity: 1; Power (Watts): 0.2W, 1/5W; Temperature Coefficient: ±150ppm/°C; Part Number: ERJ-P03D1500V; Datasheets: https://industrial.panasonic.com/cdbs/www-data/pdf/RDA0000/AOA0000C243.pdf; Image: //media.digikey.com/Photos/Panasonic%20Photos/MFG_ERJ-P6W%20Series.jpg; Digi-Key Part Number: P16013CT-ND; Quantity Available: 4150; Packaging: Cut Tape (CT); Series: ERJ; Part Status: Active; Value: 150; Tolerance: ±0.5%; Composition: Thick Film; Features: Automotive AEC-Q200, Pulse Withstanding; Operating Temperature: -55°C ~ 155°C; Package / Case: 0603 (1608 Metric); Supplier Device Package: 0603; Size / Dimension: 0.063" L x 0.031" W (1.60mm x 0.80mm); Height - Seated (Max): 0.022" (0.55mm); Number of Terminations: 2; Failure Rate: -
R147 R149 R152 R154-R158 = PRG18BB470MB1RB: as R63 on sheet lv_io_pressure; Digikey Link: https://www.digikey.com/product-detail/en/murata-electronics-north-america/PRG18BC1R0MM1RB/490-8505-1-ND/4380768; Image: //media.digikey.com/Photos/Panasonic%20Photos/ERJ-PA2-Series.jpg; Digi-Key Part Number: 490-8505-1-ND; Quantity Available: 14922; Minimum Quantity: 1; Packaging: Cut Tape (CT); Part Status: Active; Value: 1; Composition: Thick Film; Operating Temperature: -55°C ~ 125°C; Package / Case: 0603; Supplier Device Package: 0402; Size / Dimension: 0.039" L x 0.020" W (1.00mm x 0.50mm); Height - Seated (Max): 0.016" (0.40mm); Number of Terminations: 2; Failure Rate: -
U12 = NCD9830DBR2G: as U4 on sheet lv_io_pressure; Digikey P/N: NCD9830DBR2GOSCT-ND; Digikey Link: https://www.digikey.com/product-detail/en/on-semiconductor/NCD9830DBR2G/NCD9830DBR2GOSCT-ND/9086945; Cost: 2.70; Manufacturer P/N: NCD9830DBR2G